# Altium project KlusterLab r2.0.PrjPcb (part 7 of 10)

## Sheet FPGA Supply Pins.SchDoc
size A3; SheetNumber: 17; SheetTotal: 32
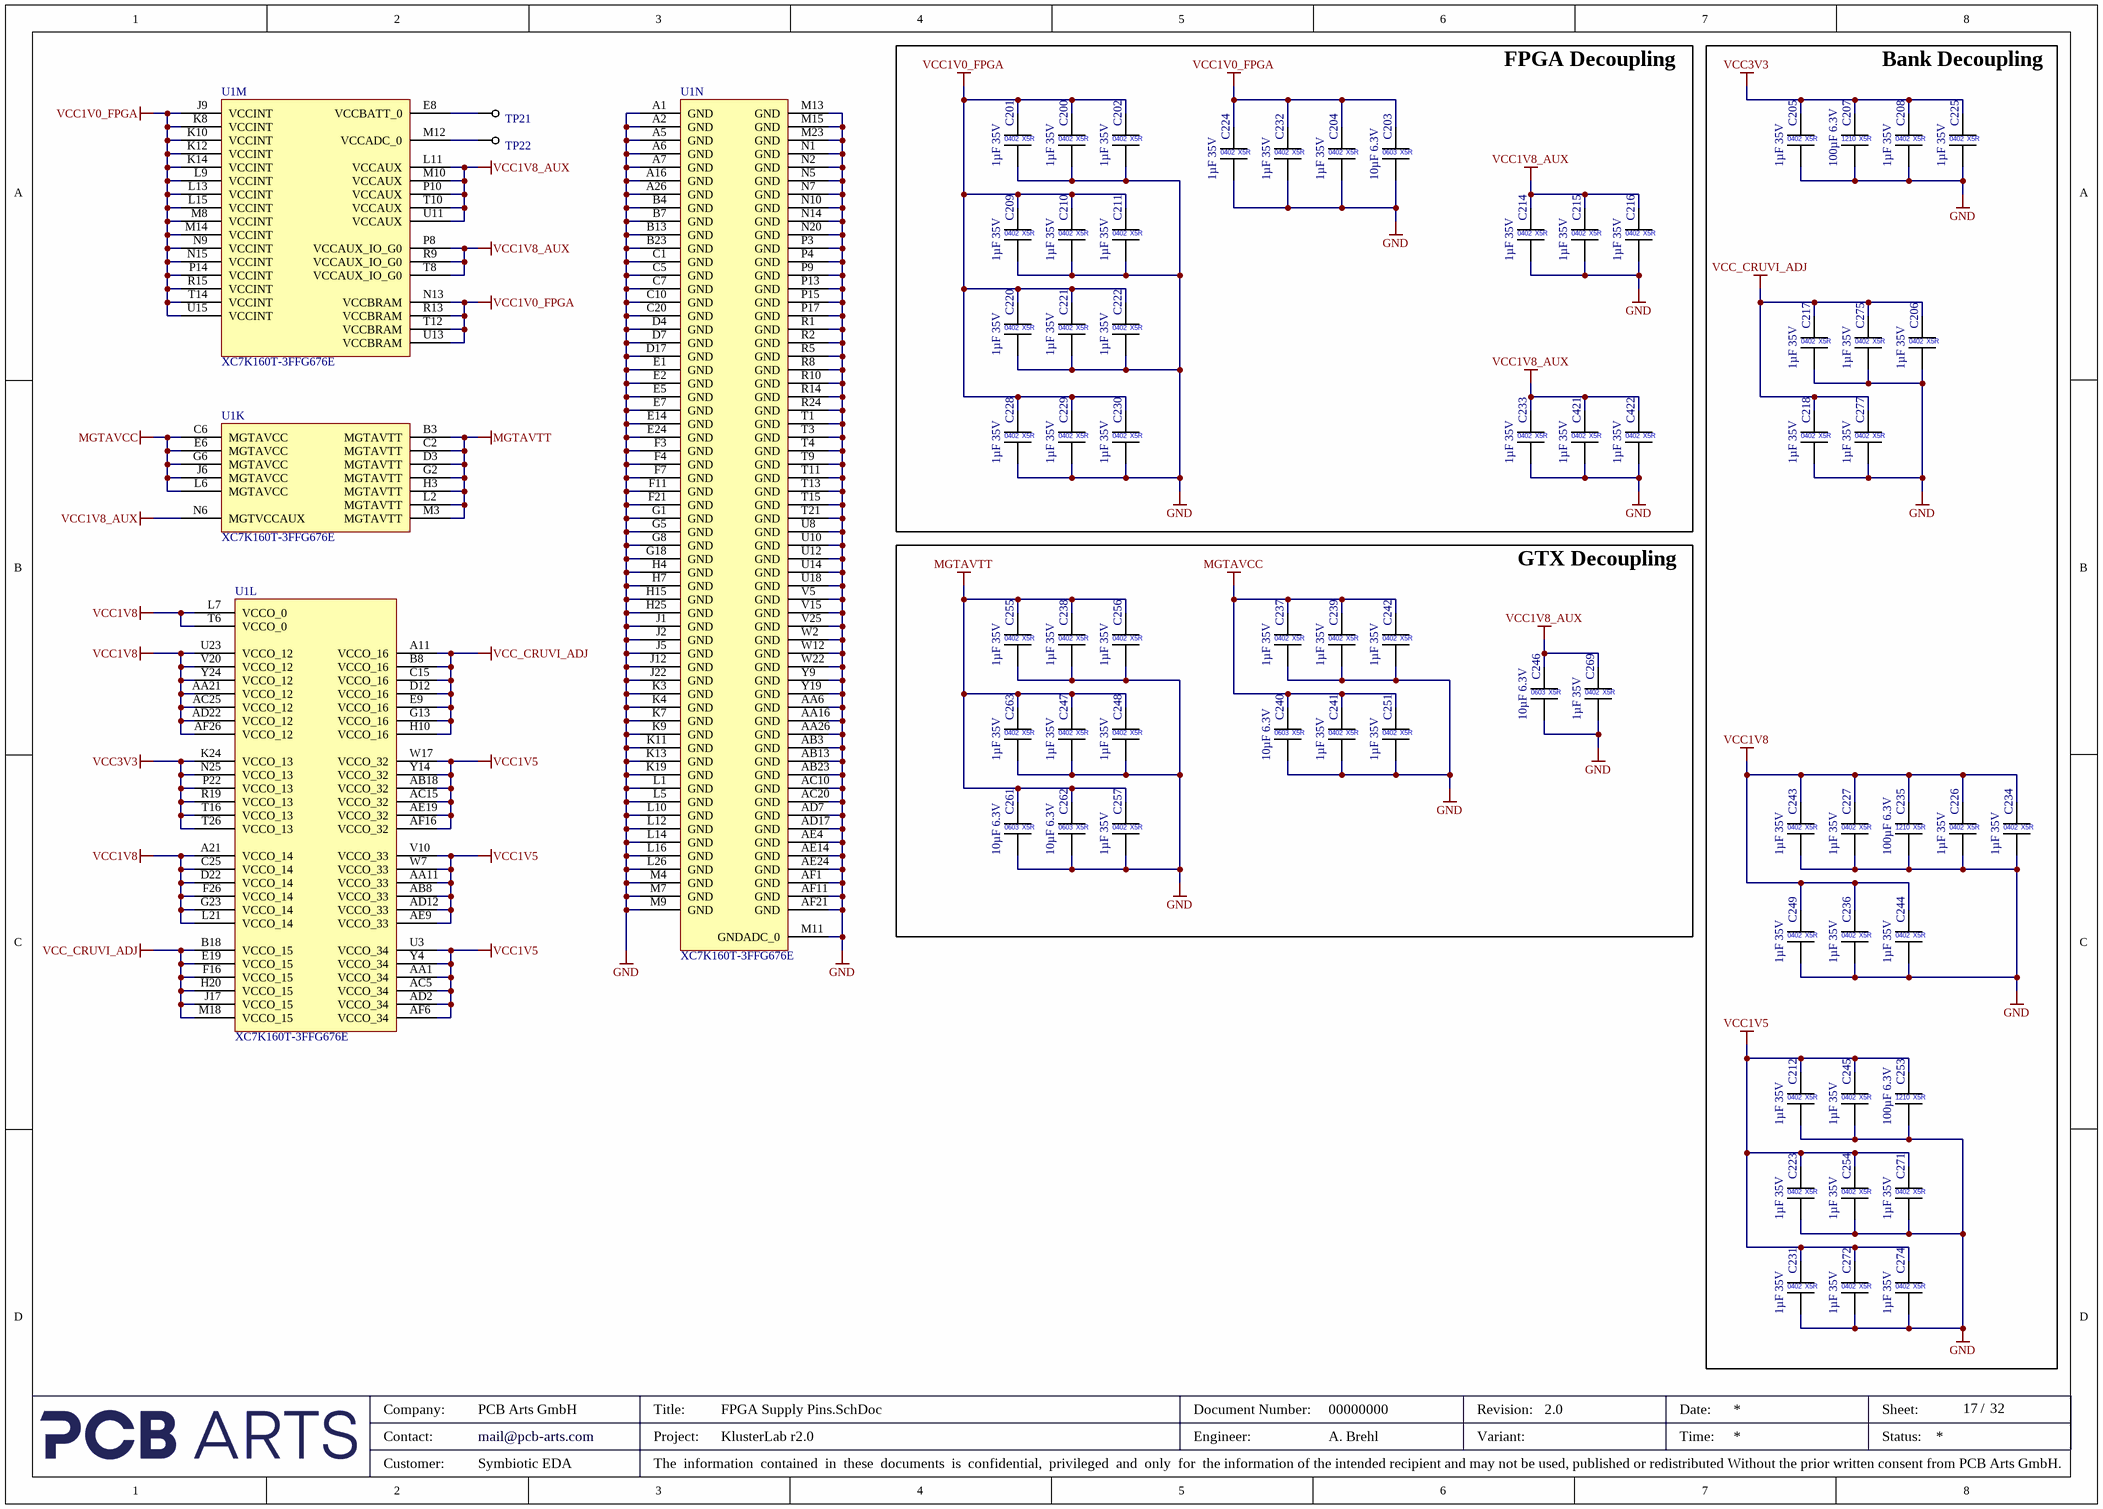
[diagram p16: FPGA Supply Pins.SchDoc]

### Parts
C200  1µF 35V  [CAP_0402_L]
C201  1µF 35V  [CAP_0402_L]
C202  1µF 35V  [CAP_0402_L]
C203  10µF 6.3V  [CAP_0603_L]
C204  1µF 35V  [CAP_0402_L]
C205  1µF 35V  [CAP_0402_L]
C206  1µF 35V  [CAP_0402_L]
C207  100µF 6.3V  [CAP_1210]
C208  1µF 35V  [CAP_0402_L]
C209  1µF 35V  [CAP_0402_L]
C210  1µF 35V  [CAP_0402_L]
C211  1µF 35V  [CAP_0402_L]
C212  1µF 35V  [CAP_0402_L]
C214  1µF 35V  [CAP_0402_L]
C215  1µF 35V  [CAP_0402_L]
C216  1µF 35V  [CAP_0402_L]
C217  1µF 35V  [CAP_0402_L]
C218  1µF 35V  [CAP_0402_L]
C220  1µF 35V  [CAP_0402_L]
C221  1µF 35V  [CAP_0402_L]
C222  1µF 35V  [CAP_0402_L]
C223  1µF 35V  [CAP_0402_L]
C224  1µF 35V  [CAP_0402_L]
C225  1µF 35V  [CAP_0402_L]
C226  1µF 35V  [CAP_0402_L]
C227  1µF 35V  [CAP_0402_L]
C228  1µF 35V  [CAP_0402_L]
C229  1µF 35V  [CAP_0402_L]
C230  1µF 35V  [CAP_0402_L]
C231  1µF 35V  [CAP_0402_L]
C232  1µF 35V  [CAP_0402_L]
C233  1µF 35V  [CAP_0402_L]
C234  1µF 35V  [CAP_0402_L]
C235  100µF 6.3V  [CAP_1210]
C236  1µF 35V  [CAP_0402_L]
C237  1µF 35V  [CAP_0402_L]
C238  1µF 35V  [CAP_0402_L]
C239  1µF 35V  [CAP_0402_L]
C240  10µF 6.3V  [CAP_0603_L]
C241  1µF 35V  [CAP_0402_L]
C242  1µF 35V  [CAP_0402_L]
C243  1µF 35V  [CAP_0402_L]
C244  1µF 35V  [CAP_0402_L]
C245  1µF 35V  [CAP_0402_L]
C246  10µF 6.3V  [CAP_0603_L]
C247  1µF 35V  [CAP_0402_L]
C248  1µF 35V  [CAP_0402_L]
C249  1µF 35V  [CAP_0402_L]
C251  1µF 35V  [CAP_0402_L]
C253  100µF 6.3V  [CAP_1210]
C254  1µF 35V  [CAP_0402_L]
C255  1µF 35V  [CAP_0402_L]
C256  1µF 35V  [CAP_0402_L]
C257  1µF 35V  [CAP_0402_L]
C261  10µF 6.3V  [CAP_0603_L]
C262  10µF 6.3V  [CAP_0603_L]
C263  1µF 35V  [CAP_0402_L]
C269  1µF 35V  [CAP_0402_L]
C271  1µF 35V  [CAP_0402_L]
C272  1µF 35V  [CAP_0402_L]
C274  1µF 35V  [CAP_0402_L]
C275  1µF 35V  [CAP_0402_L]
C277  1µF 35V  [CAP_0402_L]
C421  1µF 35V  [CAP_0402_L]
C422  1µF 35V  [CAP_0402_L]
TP21  Testpoint  [Testpoint 0.8mm]  (value not drawn)  (no BOM)
TP22  Testpoint  [Testpoint 0.8mm]  (value not drawn)  (no BOM)
U1  XC7K160T-3FFG676E  [BGA100P2700X2700X317-676N]  (parts K,L,M,N of 14)

### Blocks framed on the sheet
FPGA Decoupling: C200-C204 C209-C211 C214-C216 C220-C222 C224 C228-C230 C232 C233 C421 C422
Bank Decoupling: C205-C208 C212 C217 C218 C223 C225-C227 C231 C234-C236 C243-C245 C249 C253 C254 C271 C272 C274 C275 C277
GTX Decoupling: C237-C242 C246-C248 C251 C255-C257 C261-C263 C269

### Nets
GND: C200.2 C201.2 C202.2 C203.2 C204.2 C205.2 C206.2 C207.2 C208.2 C209.2 C210.2 C211.2 C212.2 C214.2 C215.2 C216.2 C217.2 C218.2 C220.2 C221.2 C222.2 C223.2 C224.2 C225.2 C226.2 C227.2 C228.2 C229.2 C230.2 C231.2 C232.2 C233.2 C234.2 C235.2 C236.2 C237.2 C238.2 C239.2 C240.2 C241.2 C242.2 C243.2 C244.2 C245.2 C246.2 C247.2 C248.2 C249.2 C251.2 C253.2 C254.2 C255.2 C256.2 C257.2 C261.2 C262.2 C263.2 C269.2 C271.2 C272.2 C274.2 C275.2 C277.2 C421.2 C422.2 U1.A1(GND) U1.A2(GND) U1.A5(GND) U1.A6(GND) U1.A7(GND) U1.A16(GND) U1.A26(GND) U1.AA6(GND) U1.AA16(GND) U1.AA26(GND) U1.AB3(GND) U1.AB13(GND) U1.AB23(GND) U1.AC10(GND) U1.AC20(GND) U1.AD7(GND) U1.AD17(GND) U1.AE4(GND) U1.AE14(GND) U1.AE24(GND) U1.AF1(GND) U1.AF11(GND) U1.AF21(GND) U1.B4(GND) U1.B7(GND) U1.B13(GND) U1.B23(GND) U1.C1(GND) U1.C5(GND) U1.C7(GND) U1.C10(GND) U1.C20(GND) U1.D4(GND) U1.D7(GND) U1.D17(GND) U1.E1(GND) U1.E2(GND) U1.E5(GND) U1.E7(GND) U1.E14(GND) U1.E24(GND) U1.F3(GND) U1.F4(GND) U1.F7(GND) U1.F11(GND) U1.F21(GND) U1.G1(GND) U1.G5(GND) U1.G8(GND) U1.G18(GND) U1.H4(GND) U1.H7(GND) U1.H15(GND) U1.H25(GND) U1.J1(GND) U1.J2(GND) U1.J5(GND) U1.J12(GND) U1.J22(GND) U1.K3(GND) U1.K4(GND) U1.K7(GND) U1.K9(GND) U1.K11(GND) U1.K13(GND) U1.K19(GND) U1.L1(GND) U1.L5(GND) U1.L10(GND) U1.L12(GND) U1.L14(GND) U1.L16(GND) U1.L26(GND) U1.M4(GND) U1.M7(GND) U1.M9(GND) U1.M11(GNDADC_0) U1.M13(GND) U1.M15(GND) U1.M23(GND) U1.N1(GND) U1.N2(GND) U1.N5(GND) U1.N7(GND) U1.N10(GND) U1.N14(GND) U1.N20(GND) U1.P3(GND) U1.P4(GND) U1.P9(GND) U1.P13(GND) U1.P15(GND) U1.P17(GND) U1.R1(GND) U1.R2(GND) U1.R5(GND) U1.R8(GND) U1.R10(GND) U1.R14(GND) U1.R24(GND) U1.T1(GND) U1.T3(GND) U1.T4(GND) U1.T9(GND) U1.T11(GND) U1.T13(GND) U1.T15(GND) U1.T21(GND) U1.U8(GND) U1.U10(GND) U1.U12(GND) U1.U14(GND) U1.U18(GND) U1.V5(GND) U1.V15(GND) U1.V25(GND) U1.W2(GND) U1.W12(GND) U1.W22(GND) U1.Y9(GND) U1.Y19(GND)
MGTAVCC: C237.1 C239.1 C240.1 C241.1 C242.1 C251.1 U1.C6(MGTAVCC) U1.E6(MGTAVCC) U1.G6(MGTAVCC) U1.J6(MGTAVCC) U1.L6(MGTAVCC)
MGTAVTT: C238.1 C247.1 C248.1 C255.1 C256.1 C257.1 C261.1 C262.1 C263.1 U1.B3(MGTAVTT) U1.C2(MGTAVTT) U1.D3(MGTAVTT) U1.G2(MGTAVTT) U1.H3(MGTAVTT) U1.L2(MGTAVTT) U1.M3(MGTAVTT)
VCC1V0_FPGA: C200.1 C201.1 C202.1 C203.1 C204.1 C209.1 C210.1 C211.1 C220.1 C221.1 C222.1 C224.1 C228.1 C229.1 C230.1 C232.1 U1.J9(VCCINT) U1.K8(VCCINT) U1.K10(VCCINT) U1.K12(VCCINT) U1.K14(VCCINT) U1.L9(VCCINT) U1.L13(VCCINT) U1.L15(VCCINT) U1.M8(VCCINT) U1.M14(VCCINT) U1.N9(VCCINT) U1.N13(VCCBRAM) U1.N15(VCCINT) U1.P14(VCCINT) U1.R13(VCCBRAM) U1.R15(VCCINT) U1.T12(VCCBRAM) U1.T14(VCCINT) U1.U13(VCCBRAM) U1.U15(VCCINT)
VCC1V5: C212.1 C223.1 C231.1 C245.1 C253.1 C254.1 C271.1 C272.1 C274.1 U1.AA1(VCCO_34) U1.AA11(VCCO_33) U1.AB8(VCCO_33) U1.AB18(VCCO_32) U1.AC5(VCCO_34) U1.AC15(VCCO_32) U1.AD2(VCCO_34) U1.AD12(VCCO_33) U1.AE9(VCCO_33) U1.AE19(VCCO_32) U1.AF6(VCCO_34) U1.AF16(VCCO_32) U1.U3(VCCO_34) U1.V10(VCCO_33) U1.W7(VCCO_33) U1.W17(VCCO_32) U1.Y4(VCCO_34) U1.Y14(VCCO_32)
VCC1V8: C226.1 C227.1 C234.1 C235.1 C236.1 C243.1 C244.1 C249.1 U1.A21(VCCO_14) U1.AA21(VCCO_12) U1.AC25(VCCO_12) U1.AD22(VCCO_12) U1.AF26(VCCO_12) U1.C25(VCCO_14) U1.D22(VCCO_14) U1.F26(VCCO_14) U1.G23(VCCO_14) U1.L7(VCCO_0) U1.L21(VCCO_14) U1.T6(VCCO_0) U1.U23(VCCO_12) U1.V20(VCCO_12) U1.Y24(VCCO_12)
VCC1V8_AUX: C214.1 C215.1 C216.1 C233.1 C246.1 C269.1 C421.1 C422.1 U1.L11(VCCAUX) U1.M10(VCCAUX) U1.N6(MGTVCCAUX) U1.P8(VCCAUX_IO_G0) U1.P10(VCCAUX) U1.R9(VCCAUX_IO_G0) U1.T8(VCCAUX_IO_G0) U1.T10(VCCAUX) U1.U11(VCCAUX)
VCC3V3: C205.1 C207.1 C208.1 C225.1 U1.K24(VCCO_13) U1.N25(VCCO_13) U1.P22(VCCO_13) U1.R19(VCCO_13) U1.T16(VCCO_13) U1.T26(VCCO_13)
VCC_CRUVI_ADJ: C206.1 C217.1 C218.1 C275.1 C277.1 U1.A11(VCCO_16) U1.B8(VCCO_16) U1.B18(VCCO_15) U1.C15(VCCO_16) U1.D12(VCCO_16) U1.E9(VCCO_16) U1.E19(VCCO_15) U1.F16(VCCO_15) U1.G13(VCCO_16) U1.H10(VCCO_16) U1.H20(VCCO_15) U1.J17(VCCO_15) U1.M18(VCCO_15)
NetTP21_1: TP21.1(GND) U1.E8(VCCBATT_0)
NetTP22_1: TP22.1(GND) U1.M12(VCCADC_0)

### Notes on the sheet
- Company:
- Contact:
- Customer:
- mail@pcb-arts.com
- PCB Arts GmbH
- Title:
- Project:
- The  information  contained  in  these  documents  is  confidential,  privileged  and  only  for  the information of the intended recipient and may not be used, published or redistributed Without the prior written consent from PCB Arts GmbH.
- Engineer:
- Document Number:
- Revision:
- Variant:
- Date:
- Time:
- Sheet:
- Status:
- /
- (in symbol CAP_0402_1µF_35V) 0402; X5R
- (in symbol CAP_0603_10µF_6.3V) 0603; X5R
- (in symbol CAP_1210_100µF_6.3V) 1210; X5R

### Library data of the parts
C200-C202 C204-C206 C208-C212 C214-C218 C220-C234 C236-C239 C241-C245 C247-C249 C251 C254-C257 C263 C269 C271 C272 C274 C275 C277 C421 C422 = CAP_0402_1µF_35V: Multilayer Ceramic Capacitors MLCC - SMD/SMT 0402 35VDC; Manufacturer 1: Kyocera Electronic Components; Manufacturer 1 Prt. Nr.: CM05X5R105K35AH; Manufacturer 2 Prt. Nr.: C1005X5R1V105K050BC; Manufacturer 2: TDK
C203 C240 C246 C261 C262 = CAP_0603_10µF_6.3V: Multilayer Ceramic Capacitors MLCC - SMD/SMT 0603 6.3VDC; Manufacturer 1: Murata Electronics; Manufacturer 1 Prt. Nr.: GRM188R60J106ME84J; Manufacturer 2 Prt. Nr.: JMK107ABJ106MA-T; Manufacturer 2: Taiyo Yuden
C207 C235 C253 = CAP_1210_100µF_6.3V: Multilayer Ceramic Capacitors MLCC - SMD/SMT 1210 6.3VDC; Manufacturer 1: Samsung Electro-Mechanics; Manufacturer 1 Prt. Nr.: CL32A107MQVNNWE; Manufacturer 2 Prt. Nr.: JMK325ABJ107MMHP; Manufacturer 2: Taiyo Yuden
TP21 TP22 = Testpoint 0.8mm
U1 = XC7K160T-3FFG676E_Kintex-7 FPGA, 400 User I/Os, 8 GTX, FFG676: Kintex-7 FPGA, 400 User I/Os, 8 GTX, 676-Ball BGA, Speed Grade 3, Extended Grade, Pb-Free; Manufacturer 1: Xilinx; Manufacturer 1 Prt. Nr.: XC7K160T-3FFG676E; ComponentLink1URL: http://www.xilinx.com/support/documentation/data_sheets/ds180_7Series_Overview.pdf; ComponentLink2URL: http://www.xilinx.com/support/documentation/user_guides/ug865-Zynq-7000-Pkg-Pinout.pdf; ComponentLink1Description: Datasheet; ComponentLink2Description: Package Specification

## Sheet Power-Tree.SchDoc
size A3; SheetNumber: 2; SheetTotal: 32
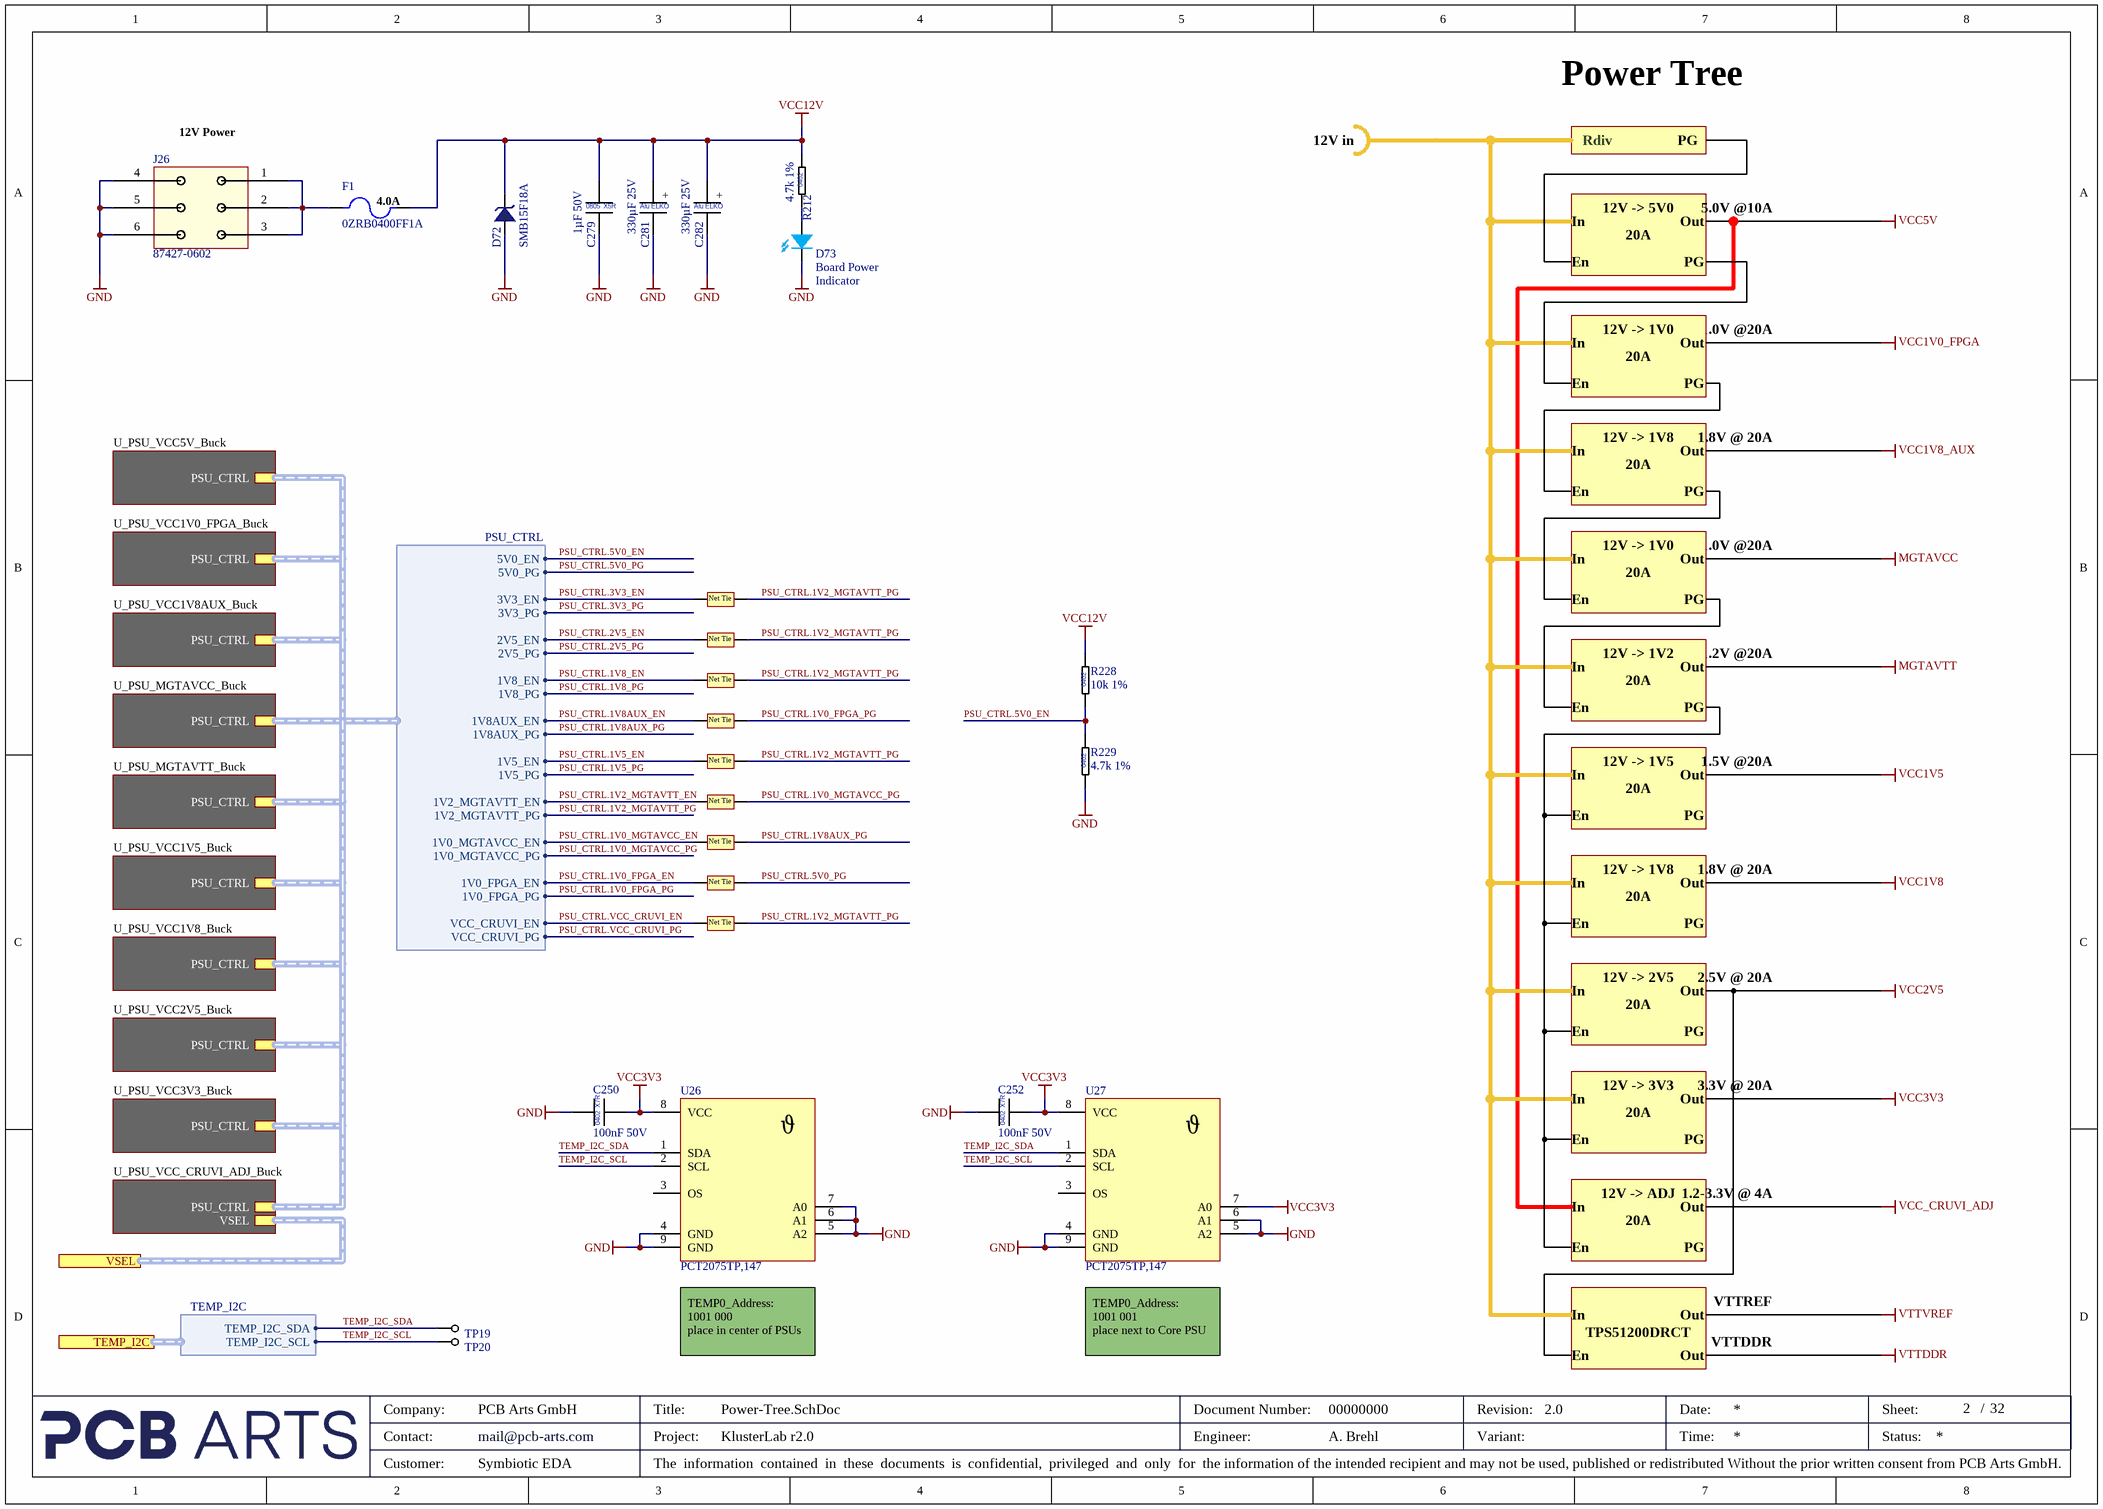
[diagram p17: Power-Tree.SchDoc]

### Parts
C250  100nF 50V  [CAP_0402_L]
C252  100nF 50V  [CAP_0402_L]
C279  1µF 50V  [CAP_0805]
C281  330µF 25V  [WCAP-PTG5_D10H12.5]
C282  330µF 25V  [WCAP-PTG5_D10H12.5]
D72  SMB15F18A  [DO221-AA]
D73  LTST-S270TBKT  [LED-0603 Sideview]  (value not drawn)
F1  0ZRB0400FF1A  [0ZRB0400FF]
J26  87427-0602  [Molex 87427-0602]
NT1  Net Tie  [Net Tie-0.3]  (value not drawn)  (net tie, no BOM)
NT2  Net Tie  [Net Tie-0.3]  (value not drawn)  (net tie, no BOM)
NT3  Net Tie  [Net Tie-0.3]  (value not drawn)  (net tie, no BOM)
NT4  Net Tie  [Net Tie-0.3]  (value not drawn)  (net tie, no BOM)
NT5  Net Tie  [Net Tie-0.3]  (value not drawn)  (net tie, no BOM)
NT6  Net Tie  [Net Tie-0.3]  (value not drawn)  (net tie, no BOM)
NT7  Net Tie  [Net Tie-0.3]  (value not drawn)  (net tie, no BOM)
NT8  Net Tie  [Net Tie-0.3]  (value not drawn)  (net tie, no BOM)
NT9  Net Tie  [Net Tie-0.3]  (value not drawn)  (net tie, no BOM)
R212  4.7k 1%  [RES_0402_L]
R228  10k 1%  [RES_0402_L]
R229  4.7k 1%  [RES_0402_L]
TP19  Testpoint  [Testpoint 0.8mm]  (value not drawn)  (no BOM)
TP20  Testpoint  [Testpoint 0.8mm]  (value not drawn)  (no BOM)
U26  PCT2075TP,147  [SOT1069-2 (HWSON8)]
U27  PCT2075TP,147  [SOT1069-2 (HWSON8)]

### Sub-sheets
U_PSU_MGTAVCC_Buck = PSU_MGTAVCC_Buck.SchDoc: PSU_CTRL (harness PSU_CTRL)
U_PSU_MGTAVTT_Buck = PSU_MGTAVTT_Buck.SchDoc: PSU_CTRL (harness PSU_CTRL)
U_PSU_VCC1V0_FPGA_Buck = PSU_VCC1V0_FPGA_Buck.SchDoc: PSU_CTRL (harness PSU_CTRL)
U_PSU_VCC1V5_Buck = PSU_VCC1V5_Buck.SchDoc: PSU_CTRL (harness PSU_CTRL)
U_PSU_VCC1V8_Buck = PSU_VCC1V8_Buck.SchDoc: PSU_CTRL (harness PSU_CTRL)
U_PSU_VCC1V8AUX_Buck = PSU_VCC1V8AUX_Buck.SchDoc: PSU_CTRL (harness PSU_CTRL)
U_PSU_VCC2V5_Buck = PSU_VCC2V5_Buck.SchDoc: PSU_CTRL (harness PSU_CTRL)
U_PSU_VCC3V3_Buck = PSU_VCC3V3_Buck.SchDoc: PSU_CTRL (harness PSU_CTRL)
U_PSU_VCC5V_Buck = PSU_VCC5V_Buck.SchDoc: PSU_CTRL (harness PSU_CTRL)
U_PSU_VCC_CRUVI_ADJ_Buck = PSU_VCC_CRUVI_ADJ_Buck.SchDoc: PSU_CTRL (harness PSU_CTRL), VSEL (harness VSEL)

### Ports
TEMP_I2C (harness TEMP_I2C, see Top-Level-Sheet[6D], SMI Bank 12[1C]), VSEL (harness VSEL, see Top-Level-Sheet[6C], Bank 13_Bank 15_Bank 16[8D], PSU_VCC_CRUVI_ADJ_Buck[1C])

### Harnesses
TEMP_I2C: TEMP_I2C_SCL, TEMP_I2C_SDA
PSU_CTRL: 5V0_EN, 5V0_PG, 3V3_EN, 3V3_PG, 2V5_EN, 2V5_PG, 1V8_EN, 1V8_PG, 1V8AUX_EN, 1V8AUX_PG, 1V5_EN, 1V5_PG, 1V2_MGTAVTT_EN, 1V2_MGTAVTT_PG, 1V0_MGTAVCC_EN, 1V0_MGTAVCC_PG, 1V0_FPGA_EN, 1V0_FPGA_PG, VCC_CRUVI_EN, VCC_CRUVI_PG

### Nets
GND: C250.1 C252.1 C279.2 C281.2 C282.2 D72.2 D73.1 J26.4 J26.5 J26.6 R229.1 U26.4(GND) U26.5(A2) U26.6(A1) U26.7(A0) U26.9(GND) U27.4(GND) U27.5(A2) U27.6(A1) U27.9(GND)
VCC3V3: C250.2 C252.2 U26.8(VCC) U27.7(A0) U27.8(VCC)
VCC12V: C279.1 C281.1 C282.1 D72.1 F1.2 R212.2 R228.2
PSU_CTRL.1V0_FPGA_EN: NT8.1 ; sheet U_PSU_MGTAVCC_Buck/PSU_CTRL.1V0_FPGA_EN
PSU_CTRL.1V0_FPGA_PG: NT4.2 ; sheet U_PSU_MGTAVCC_Buck/PSU_CTRL.1V0_FPGA_PG
PSU_CTRL.1V0_MGTAVCC_EN: NT7.1 ; sheet U_PSU_MGTAVCC_Buck/PSU_CTRL.1V0_MGTAVCC_EN
PSU_CTRL.1V0_MGTAVCC_PG: NT6.2 ; sheet U_PSU_MGTAVCC_Buck/PSU_CTRL.1V0_MGTAVCC_PG
PSU_CTRL.1V2_MGTAVTT_EN: NT6.1 ; sheet U_PSU_MGTAVCC_Buck/PSU_CTRL.1V2_MGTAVTT_EN
PSU_CTRL.1V2_MGTAVTT_PG: NT1.2 NT2.2 NT3.2 NT5.2 NT9.2 ; sheet U_PSU_MGTAVCC_Buck/PSU_CTRL.1V2_MGTAVTT_PG
PSU_CTRL.1V5_EN: NT5.1 ; sheet U_PSU_MGTAVCC_Buck/PSU_CTRL.1V5_EN
PSU_CTRL.1V8_EN: NT3.1 ; sheet U_PSU_MGTAVCC_Buck/PSU_CTRL.1V8_EN
PSU_CTRL.1V8AUX_EN: NT4.1 ; sheet U_PSU_MGTAVCC_Buck/PSU_CTRL.1V8AUX_EN
PSU_CTRL.1V8AUX_PG: NT7.2 ; sheet U_PSU_MGTAVCC_Buck/PSU_CTRL.1V8AUX_PG
PSU_CTRL.2V5_EN: NT2.1 ; sheet U_PSU_MGTAVCC_Buck/PSU_CTRL.2V5_EN
PSU_CTRL.3V3_EN: NT1.1 ; sheet U_PSU_MGTAVCC_Buck/PSU_CTRL.3V3_EN
PSU_CTRL.5V0_EN: R228.1 R229.2 ; sheet U_PSU_MGTAVCC_Buck/PSU_CTRL.5V0_EN
PSU_CTRL.5V0_PG: NT8.2 ; sheet U_PSU_MGTAVCC_Buck/PSU_CTRL.5V0_PG
PSU_CTRL.VCC_CRUVI_EN: NT9.1 ; sheet U_PSU_MGTAVCC_Buck/PSU_CTRL.VCC_CRUVI_EN
TEMP_I2C_SCL: TP20.1(GND) U26.2(SCL) U27.2(SCL) ; port TEMP_I2C.TEMP_I2C_SCL
TEMP_I2C_SDA: TP19.1(GND) U26.1(SDA) U27.1(SDA) ; port TEMP_I2C.TEMP_I2C_SDA
NetD73_2: D73.2 R212.1
NetF1_1: F1.1 J26.1 J26.2 J26.3

Not connected (* = marked no-connect by the designer): U26 3(OS); U27 3(OS)

### Buses and harness runs
harness port VSEL = sheet U_PSU_VCC_CRUVI_ADJ_Buck/VSEL
harness sheet U_PSU_MGTAVCC_Buck/PSU_CTRL = sheet U_PSU_MGTAVTT_Buck/PSU_CTRL = sheet U_PSU_VCC1V0_FPGA_Buck/PSU_CTRL = sheet U_PSU_VCC1V5_Buck/PSU_CTRL = sheet U_PSU_VCC1V8_Buck/PSU_CTRL = sheet U_PSU_VCC1V8AUX_Buck/PSU_CTRL = sheet U_PSU_VCC2V5_Buck/PSU_CTRL = sheet U_PSU_VCC3V3_Buck/PSU_CTRL = sheet U_PSU_VCC5V_Buck/PSU_CTRL = sheet U_PSU_VCC_CRUVI_ADJ_Buck/PSU_CTRL

### Notes on the sheet
- Power Tree
- (near J26) 12V Power
- 12V in
- Rdiv
- PG
- In
- 12V -> 5V0
- 20A
- Out
- 5.0V @10A
- VCC5V
- (near D73) Board Power
- (near D73) Indicator
- En
- 12V -> 1V0
- 1.0V @20A
- VCC1V0_FPGA
- 12V -> 1V8
- 1.8V @ 20A
- VCC1V8_AUX
- MGTAVCC
- 12V -> 1V2
- 1.2V @20A
- MGTAVTT
- 12V -> 1V5
- 1.5V @20A
- VCC1V5
- VCC1V8
- 12V -> 2V5
- 2.5V @ 20A
- VCC2V5
- 12V -> 3V3
- 3.3V @ 20A
- VCC3V3
- 12V -> ADJ
- 1.2-3.3V @ 4A
- VCC_CRUVI_ADJ
- VTTREF
- VTTVREF
- (near U26) TEMP0_Address:
  1001 000
  place in center of PSUs
- (near U27) TEMP0_Address:
  1001 001
  place next to Core PSU
- TPS51200DRCT
- VTTDDR
- Company:
- Contact:
- Customer:
- mail@pcb-arts.com
- PCB Arts GmbH
- Title:
- Project:
- The  information  contained  in  these  documents  is  confidential,  privileged  and  only  for  the information of the intended recipient and may not be used, published or redistributed Without the prior written consent from PCB Arts GmbH.
- Engineer:
- Document Number:
- Revision:
- Variant:
- Date:
- Time:
- Sheet:
- Status:
- /
- (in symbol 0ZRB0400FF1A_Rückstellbare Sicherung 4.0A, 30V) 4.0A
- (in symbol CAP_0402_100nF_50V) X7R; 0402
- (in symbol CAP_0805_1µF_50V) 0805; X5R
- (in symbol CAP_D10L12.5_330µF_25V) +; Alu ELKO
- (in symbol PCT2075TP,147_Digital Temp Sensor I2C) ϑ
- (in symbol RES_0402_4.7k_1%) 0402
- (in symbol RES_0402_10k_1%) 0402

### Library data of the parts
C250 C252 = CAP_0402_100nF_50V: Multilayer Ceramic Capacitors MLCC - SMD/SMT 0402 50VDC; Manufacturer 1: Murata Electronics; Manufacturer 1 Prt. Nr.: GCM155L8EH104KE07D; Manufacturer 2 Prt. Nr.: UMK105B7104KV-FR; Manufacturer 2: TDK
C279 = CAP_0805_1µF_50V: Multilayer Ceramic Capacitors MLCC - SMD/SMT 0805 50VDC; Manufacturer 1: Samsung Electro-Mechanics; Manufacturer 1 Prt. Nr.: CL21B105KBFNNNG; Manufacturer 2 Prt. Nr.: UMK212BJ105KGHT; Manufacturer 2: Taiyo Yuden
C281 C282 = CAP_D10L12.5_330µF_25V: Organische Polymer-Aluminiumkondensatoren 330uF 25 Volts 20% AEC-Q200; Manufacturer 1: Würth Elektronik; Manufacturer 1 Prt. Nr.: 870025575009
D72 = SMB15F18A_ESD-Entstörer/TVS-Dioden 1500 W, 18 V TVS: ESD-Entstörer/TVS-Dioden 1500 W, 18 V TVS; Manufacturer 1: STMicroelectronics; Manufacturer 1 Prt. Nr.: SMB15F18A
D73 = LED 0603 Blue Sideview: BLUE  0603 Light Emitting Diode; Manufacturer 1: lite-On; Manufacturer 1 Prt. Nr.: LTST-S270TBKT; Color: Blue
F1 = 0ZRB0400FF1A_Rückstellbare Sicherung 4.0A, 30V: Rückstellbare Sicherung 4.0A, 30V; Manufacturer 1: Bel Fuse; Manufacturer 1 Prt. Nr.: 0ZRB0400FF1A
J26 = 87427-0602_Mini-Fit Jr. Right angle Header, 4.20mm Pitch, Dual Row, 6 Circuits: Mini-Fit Jr. Right angle Header, 4.20mm Pitch, Dual Row, 6 Circuits; Manufacturer 1: MOLEX; Manufacturer 1 Prt. Nr.: 874270602
R212 R229 = RES_0402_4.7k_1%: Thick Film Resistors - SMD 4.7kOhm 1%; Manufacturer 1: Vishay / Dale; Manufacturer 1 Prt. Nr.: CRCW04024K70FKEDC; Manufacturer 2 Prt. Nr.: RC0402FR-134K7L; Manufacturer 2: Yageo
R228 = RES_0402_10k_1%: Thick Film Resistors - SMD 10kOhm 1%; Manufacturer 1: Vishay / Dale; Manufacturer 1 Prt. Nr.: CRCW040210K0FKEDC; Manufacturer 2 Prt. Nr.: RC0402FR-7W10KL; Manufacturer 2: Yageo
TP19 TP20 = Testpoint 0.8mm
U26 U27 = PCT2075TP,147_Digital Temp Sensor I2C: Digital Temp Sensor I2C; Manufacturer 1: NXP; Manufacturer 1 Prt. Nr.: PCT2075TP,147

## Sheet PSU_MGTAVCC_Buck.SchDoc
size A3; SheetNumber: 9; SheetTotal: 32
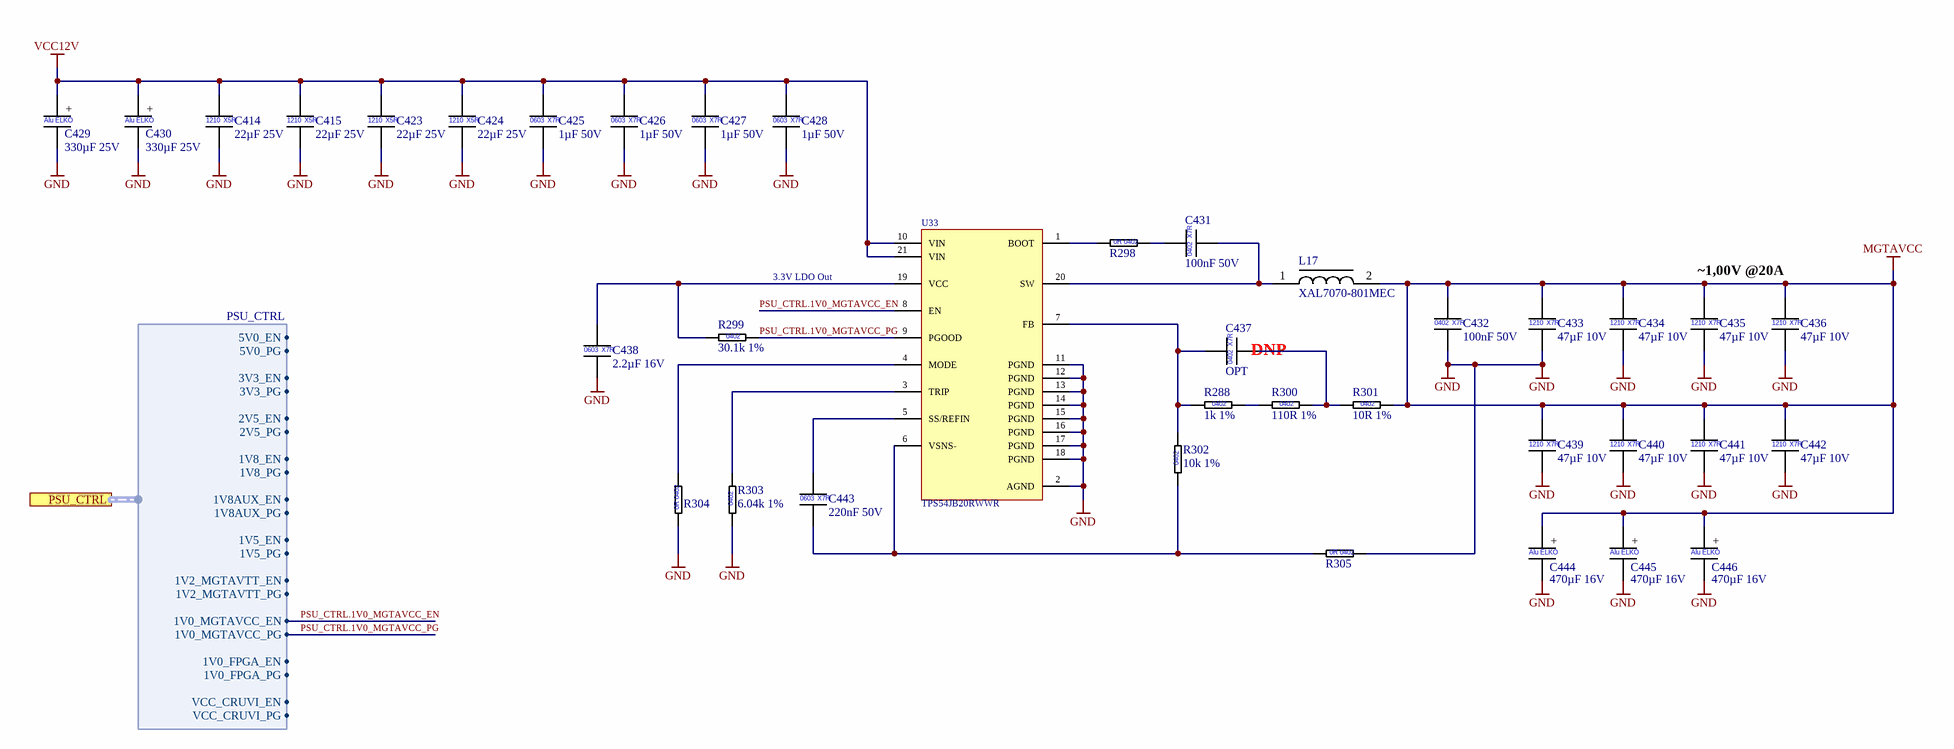
[diagram p18: PSU_MGTAVCC_Buck.SchDoc]

### Parts
C414  22µF 25V  [CAP_1210]
C415  22µF 25V  [CAP_1210]
C423  22µF 25V  [CAP_1210]
C424  22µF 25V  [CAP_1210]
C425  1µF 50V  [CAP_0603]
C426  1µF 50V  [CAP_0603]
C427  1µF 50V  [CAP_0603]
C428  1µF 50V  [CAP_0603]
C429  330µF 25V  [WCAP-PTG5_D10H12.5]
C430  330µF 25V  [WCAP-PTG5_D10H12.5]
C431  100nF 50V  [CAP_0402]
C432  100nF 50V  [CAP_0402]
C433  47µF 10V  [CAP_1210]
C434  47µF 10V  [CAP_1210]
C435  47µF 10V  [CAP_1210]
C436  47µF 10V  [CAP_1210]
C437  OPT  [CAP_0402]  (no BOM)
C438  2.2µF 16V  [CAP_0603]
C439  47µF 10V  [CAP_1210]
C440  47µF 10V  [CAP_1210]
C441  47µF 10V  [CAP_1210]
C442  47µF 10V  [CAP_1210]
C443  220nF 50V  [CAP_0603]
C444  470µF 16V  [WCAP-PTG5_D8H13]
C445  470µF 16V  [WCAP-PTG5_D8H13]
C446  470µF 16V  [WCAP-PTG5_D8H13]
L17  XAL7070-801MEC  [COILCRAFT_XAL7070]
R288  1k 1%  [RES_0402]
R298  0R Jumper  [RES_0402]  (value not drawn)
R299  30.1k 1%  [RES_0402]
R300  110R 1%  [RES_0402]
R301  10R 1%  [RES_0402]
R302  10k 1%  [RES_0402]
R303  6.04k 1%  [RES_0402]
R304  0R Jumper  [RES_0402]  (value not drawn)
R305  0R Jumper  [RES_0402]  (value not drawn)
U33  TPS54JB20RWWR  [VQFN-HR21_RWW0021A]

### Ports
PSU_CTRL (harness PSU_CTRL, see Power-Tree[2B], PSU_MGTAVTT_Buck[1B], PSU_VCC1V0_FPGA_Buck[1B], PSU_VCC1V5_Buck[1B], PSU_VCC1V8_Buck[1B], PSU_VCC1V8AUX_Buck[1B], PSU_VCC2V5_Buck[1B], PSU_VCC3V3_Buck[1B], PSU_VCC5V_Buck[1B], PSU_VCC_CRUVI_ADJ_Buck[1B])

### Harnesses
PSU_CTRL: 5V0_EN, 5V0_PG, 3V3_EN, 3V3_PG, 2V5_EN, 2V5_PG, 1V8_EN, 1V8_PG, 1V8AUX_EN, 1V8AUX_PG, 1V5_EN, 1V5_PG, 1V2_MGTAVTT_EN, 1V2_MGTAVTT_PG, 1V0_MGTAVCC_EN, 1V0_MGTAVCC_PG, 1V0_FPGA_EN, 1V0_FPGA_PG, VCC_CRUVI_EN, VCC_CRUVI_PG

### Nets
GND: C414.2 C415.2 C423.2 C424.2 C425.2 C426.2 C427.2 C428.2 C429.2 C430.2 C432.2 C433.2 C434.2 C435.2 C436.2 C438.2 C439.2 C440.2 C441.2 C442.2 C444.2 C445.2 C446.2 R303.1 R304.1 R305.2 U33.2(AGND) U33.11(PGND) U33.12(PGND) U33.13(PGND) U33.14(PGND) U33.15(PGND) U33.16(PGND) U33.17(PGND) U33.18(PGND)
MGTAVCC: C432.1 C433.1 C434.1 C435.1 C436.1 C439.1 C440.1 C441.1 C442.1 C444.1 C445.1 C446.1 L17.2 R301.2
VCC12V: C414.1 C415.1 C423.1 C424.1 C425.1 C426.1 C427.1 C428.1 C429.1 C430.1 U33.10(VIN) U33.21(VIN)
PSU_CTRL.1V0_MGTAVCC_EN: U33.8(EN) ; port PSU_CTRL.1V0_MGTAVCC_EN
PSU_CTRL.1V0_MGTAVCC_PG: R299.2 U33.9(PGOOD) ; port PSU_CTRL.1V0_MGTAVCC_PG
NetC431_1: C431.1 R298.2
NetC431_2: C431.2 L17.1 U33.20(SW)
NetC437_1: C437.1 R288.1 R302.2 U33.7(FB)
NetC437_2: C437.2 R300.2 R301.1
NetC438_1: C438.1 R299.1 U33.19(VCC)
NetC443_1: C443.1 U33.5(SS/REFIN)
NetC443_2: C443.2 R302.1 R305.1 U33.6(VSNS-)
NetR288_2: R288.2 R300.1
NetR298_1: R298.1 U33.1(BOOT)
NetR303_2: R303.2 U33.3(TRIP)
NetR304_2: R304.2 U33.4(MODE)

### Notes on the sheet
- 3.3V LDO Out
- (near C436) ~1,00V @20A
- (near C437) DNP
- Company:
- Contact:
- Customer:
- mail@pcb-arts.com
- PCB Arts GmbH
- Title:
- Project:
- The  information  contained  in  these  documents  is  confidential,  privileged  and  only  for  the information of the intended recipient and may not be used, published or redistributed Without the prior written consent from PCB Arts GmbH.
- Engineer:
- Document Number:
- Revision:
- Variant:
- Date:
- Time:
- Sheet:
- Status:
- /
- (in symbol CAP_0402_100nF_50V) X7R; 0402
- (in symbol CAP_0402_OPT) X7R; 0402
- (in symbol CAP_0603_1µF_50V_X7R_10%) 0603; X7R
- (in symbol CAP_0603_2.2µF_16V_X7R_10%) 0603; X7R
- (in symbol CAP_0603_220nF_50V_X7R_10%) 0603; X7R
- (in symbol CAP_1210_22µF_25V) 1210; X5R
- (in symbol CAP_1210_47µF_10V_X7R_10%) 1210; X7R
- (in symbol CAP_D8L9_470µF_16V) +; Alu ELKO
- (in symbol CAP_D10L12.5_330µF_25V) +; Alu ELKO
- (in symbol RES_0402_0R Jumper) 0R 0402
- (in symbol RES_0402_1k_1%) 0402
- (in symbol RES_0402_6.04k_1%) 0402
- (in symbol RES_0402_10k_1%) 0402
- (in symbol RES_0402_10R_1%) 0402
- (in symbol RES_0402_30.1k_1%) 0402
- (in symbol RES_0402_110R_1%) 0402

### Library data of the parts
C414 C415 C423 C424 = CAP_1210_22µF_25V: Multilayer Ceramic Capacitors MLCC - SMD/SMT 1210 25VDC; Manufacturer 1: KEMET; Manufacturer 1 Prt. Nr.: C1210C226K3PACTU; Manufacturer 2 Prt. Nr.: TMK212BBJ226MG-TT; Manufacturer 2: Taiyo Yuden
C425-C428 = CAP_0603_1µF_50V_X7R_10%: Multilayer Ceramic Capacitors MLCC - SMD/SMT 50V 1uF X7R 0603 10%; Manufacturer 1: KYOCERA AVX; Manufacturer 1 Prt. Nr.: 06035C105KAT2A; Manufacturer 2 Prt. Nr.: MSASU168AB7105KTNA01; Manufacturer 2: TAIYO YUDEN
C429 C430 = CAP_D10L12.5_330µF_25V: as C281 on sheet Power-Tree
C431 C432 = CAP_0402_100nF_50V: as C250 on sheet Power-Tree; Manufacturer 2: TDK
C433-C436 C439-C442 = CAP_1210_47µF_10V_X7R_10%: Multilayer Ceramic Capacitors MLCC - SMD/SMT 47 uF 10 VDC 10% 1210 X7R; Manufacturer 1: Murata Electronics; Manufacturer 1 Prt. Nr.: GRM32ER71A476KE15L; Manufacturer 2 Prt. Nr.: C1210C106K8RACTU; Manufacturer 2: KEMET
C437 = CAP_0402_OPT: Multilayer Ceramic Capacitors MLCC - SMD/SMT 0402 Optional Placeholder
C438 = CAP_0603_2.2µF_16V_X7R_10%: Multilayer Ceramic Capacitors MLCC - SMD/SMT 2.2 uF 16 VDC 10% 0603 X7R; Manufacturer 1: Murata Electronics; Manufacturer 1 Prt. Nr.: GRM188Z71C225KE43D; Manufacturer 2 Prt. Nr.: EMK107BB7225KA-T; Manufacturer 2: TAIYO YUDEN
C443 = CAP_0603_220nF_50V_X7R_10%: Multilayer Ceramic Capacitors MLCC - SMD/SMT 0.22 uF 50 VDC 10% 0603 X7R; Manufacturer 1: Murata Electronics; Manufacturer 1 Prt. Nr.: GRJ188R71H224KE11D; Manufacturer 2 Prt. Nr.: CGA3E3X7R1H224K080AE; Manufacturer 2: TDK
C444-C446 = CAP_D8L9_470µF_16V: Organische Polymer-Aluminiumkondensatoren 470uF 16 Volts 20%; Manufacturer 1: Würth Elektronik; Manufacturer 1 Prt. Nr.: 870025374007
L17 = XAL7070-801MEC_Power Inductors SMD 800nH Shld 20% 25.8A 2.29mOhms AECQ200: Power Inductors - SMD 800nH Shld 20% 25.8A 2.29mOhms AECQ200; Manufacturer 1: Coilcraft; Manufacturer 1 Prt. Nr.: XAL7070-801MEC
R288 = RES_0402_1k_1%: Thick Film Resistors - SMD 1kOhm 1%; Manufacturer 1: Vishay / Dale; Manufacturer 1 Prt. Nr.: CRCW04021K00FKEDC; Manufacturer 2 Prt. Nr.: RC0402FR-7W1KL; Manufacturer 2: Yageo
R298 R304 R305 = RES_0402_0R Jumper: Thick Film Resistors - SMD 0Ohm; Manufacturer 1: Vishay / Dale; Manufacturer 1 Prt. Nr.: CRCW04020000Z0EDC; Manufacturer 2 Prt. Nr.: RC0402JR-070RL; Manufacturer 2: Yageo
R299 = RES_0402_30.1k_1%: Thick Film Resistors - SMD 30.1kOhm 1%; Manufacturer 1: Vishay / Dale; Manufacturer 1 Prt. Nr.: CRCW040230K1FKEDC; Manufacturer 2 Prt. Nr.: RC0402FR-1330K1L; Manufacturer 2: Yageo
R300 = RES_0402_110R_1%: Thick Film Resistors - SMD 110Ohm 1%; Manufacturer 1: Vishay / Dale; Manufacturer 1 Prt. Nr.: CRCW0402110RFKTD; Manufacturer 2 Prt. Nr.: RC0402FR-7W110RL; Manufacturer 2: Yageo
R301 = RES_0402_10R_1%: Thick Film Resistors - SMD 10Ohm 1%; Manufacturer 1: Vishay / Dale; Manufacturer 1 Prt. Nr.: CRCW040210R0FKEE; Manufacturer 2 Prt. Nr.: RC0402FR-7W10RL; Manufacturer 2: Yageo
R302 = RES_0402_10k_1%: as R228 on sheet Power-Tree; Manufacturer 2: Yageo
R303 = RES_0402_6.04k_1%: Thick Film Resistors - SMD 6.04kOhm 1%; Manufacturer 1: Vishay / Dale; Manufacturer 1 Prt. Nr.: CRCW04026K04FKEDC; Manufacturer 2 Prt. Nr.: RC0402FR-7W6K04L; Manufacturer 2: Yageo
U33 = TPS54JB20RWWR_Switching Voltage Regulators 2.7-V to 16-V input 20-A synchronous Buck: Switching Voltage Regulators 2.7-V to 16-V input 20-A synchronous Buck; Manufacturer 1: Texas Instruments; Manufacturer 1 Prt. Nr.: TPS54JB20RWWR

## Sheet PSU_MGTAVTT_Buck.SchDoc
size A3; SheetNumber: 8; SheetTotal: 32
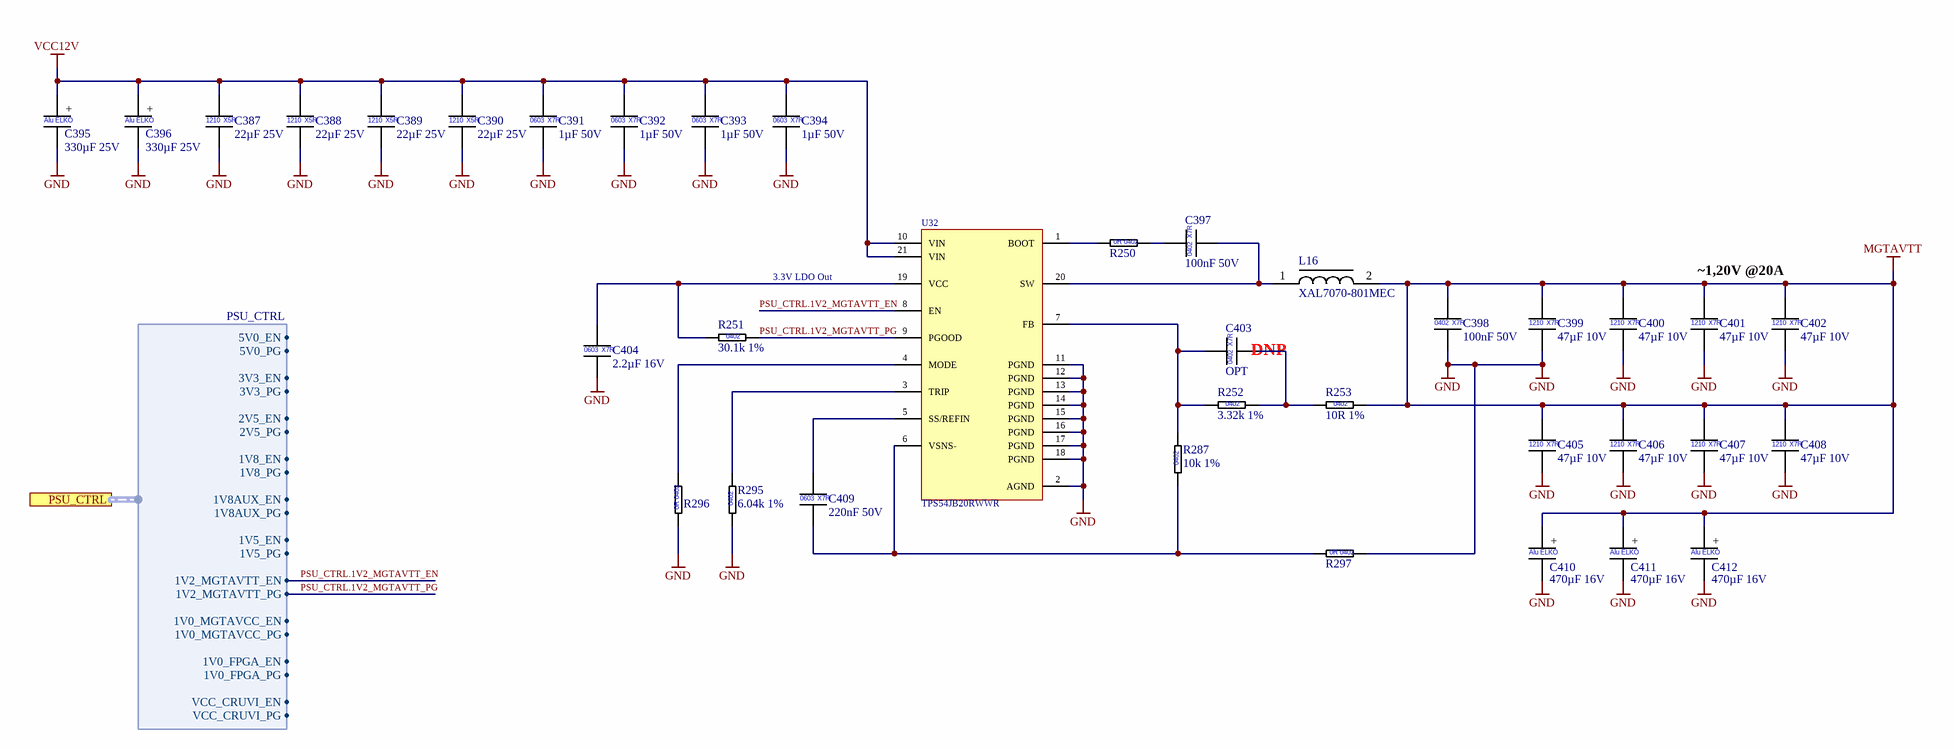
[diagram p19: PSU_MGTAVTT_Buck.SchDoc]

### Parts
C387  22µF 25V  [CAP_1210]
C388  22µF 25V  [CAP_1210]
C389  22µF 25V  [CAP_1210]
C390  22µF 25V  [CAP_1210]
C391  1µF 50V  [CAP_0603]
C392  1µF 50V  [CAP_0603]
C393  1µF 50V  [CAP_0603]
C394  1µF 50V  [CAP_0603]
C395  330µF 25V  [WCAP-PTG5_D10H12.5]
C396  330µF 25V  [WCAP-PTG5_D10H12.5]
C397  100nF 50V  [CAP_0402]
C398  100nF 50V  [CAP_0402]
C399  47µF 10V  [CAP_1210]
C400  47µF 10V  [CAP_1210]
C401  47µF 10V  [CAP_1210]
C402  47µF 10V  [CAP_1210]
C403  OPT  [CAP_0402]  (no BOM)
C404  2.2µF 16V  [CAP_0603]
C405  47µF 10V  [CAP_1210]
C406  47µF 10V  [CAP_1210]
C407  47µF 10V  [CAP_1210]
C408  47µF 10V  [CAP_1210]
C409  220nF 50V  [CAP_0603]
C410  470µF 16V  [WCAP-PTG5_D8H13]
C411  470µF 16V  [WCAP-PTG5_D8H13]
C412  470µF 16V  [WCAP-PTG5_D8H13]
L16  XAL7070-801MEC  [COILCRAFT_XAL7070]
R250  0R Jumper  [RES_0402]  (value not drawn)
R251  30.1k 1%  [RES_0402]
R252  3.32k 1%  [RES_0402]
R253  10R 1%  [RES_0402]
R287  10k 1%  [RES_0402]
R295  6.04k 1%  [RES_0402]
R296  0R Jumper  [RES_0402]  (value not drawn)
R297  0R Jumper  [RES_0402]  (value not drawn)
U32  TPS54JB20RWWR  [VQFN-HR21_RWW0021A]

### Ports
PSU_CTRL (harness PSU_CTRL, see Power-Tree[2C], PSU_MGTAVCC_Buck[1B], PSU_VCC1V0_FPGA_Buck[1B], PSU_VCC1V5_Buck[1B], PSU_VCC1V8_Buck[1B], PSU_VCC1V8AUX_Buck[1B], PSU_VCC2V5_Buck[1B], PSU_VCC3V3_Buck[1B], PSU_VCC5V_Buck[1B], PSU_VCC_CRUVI_ADJ_Buck[1B])

### Harnesses
PSU_CTRL: 5V0_EN, 5V0_PG, 3V3_EN, 3V3_PG, 2V5_EN, 2V5_PG, 1V8_EN, 1V8_PG, 1V8AUX_EN, 1V8AUX_PG, 1V5_EN, 1V5_PG, 1V2_MGTAVTT_EN, 1V2_MGTAVTT_PG, 1V0_MGTAVCC_EN, 1V0_MGTAVCC_PG, 1V0_FPGA_EN, 1V0_FPGA_PG, VCC_CRUVI_EN, VCC_CRUVI_PG

### Nets
GND: C387.2 C388.2 C389.2 C390.2 C391.2 C392.2 C393.2 C394.2 C395.2 C396.2 C398.2 C399.2 C400.2 C401.2 C402.2 C404.2 C405.2 C406.2 C407.2 C408.2 C410.2 C411.2 C412.2 R295.1 R296.1 R297.2 U32.2(AGND) U32.11(PGND) U32.12(PGND) U32.13(PGND) U32.14(PGND) U32.15(PGND) U32.16(PGND) U32.17(PGND) U32.18(PGND)
MGTAVTT: C398.1 C399.1 C400.1 C401.1 C402.1 C405.1 C406.1 C407.1 C408.1 C410.1 C411.1 C412.1 L16.2 R253.2
VCC12V: C387.1 C388.1 C389.1 C390.1 C391.1 C392.1 C393.1 C394.1 C395.1 C396.1 U32.10(VIN) U32.21(VIN)
PSU_CTRL.1V2_MGTAVTT_EN: U32.8(EN) ; port PSU_CTRL.1V2_MGTAVTT_EN
PSU_CTRL.1V2_MGTAVTT_PG: R251.2 U32.9(PGOOD) ; port PSU_CTRL.1V2_MGTAVTT_PG
NetC397_1: C397.1 R250.2
NetC397_2: C397.2 L16.1 U32.20(SW)
NetC403_1: C403.1 R252.1 R287.2 U32.7(FB)
NetC403_2: C403.2 R252.2 R253.1
NetC404_1: C404.1 R251.1 U32.19(VCC)
NetC409_1: C409.1 U32.5(SS/REFIN)
NetC409_2: C409.2 R287.1 R297.1 U32.6(VSNS-)
NetR250_1: R250.1 U32.1(BOOT)
NetR295_2: R295.2 U32.3(TRIP)
NetR296_2: R296.2 U32.4(MODE)

### Notes on the sheet
- 3.3V LDO Out
- (near C402) ~1,20V @20A
- (near C403) DNP
- Company:
- Contact:
- Customer:
- mail@pcb-arts.com
- PCB Arts GmbH
- Title:
- Project:
- The  information  contained  in  these  documents  is  confidential,  privileged  and  only  for  the information of the intended recipient and may not be used, published or redistributed Without the prior written consent from PCB Arts GmbH.
- Engineer:
- Document Number:
- Revision:
- Variant:
- Date:
- Time:
- Sheet:
- Status:
- /
- (in symbol CAP_0402_100nF_50V) X7R; 0402
- (in symbol CAP_0402_OPT) X7R; 0402
- (in symbol CAP_0603_1µF_50V_X7R_10%) 0603; X7R
- (in symbol CAP_0603_2.2µF_16V_X7R_10%) 0603; X7R
- (in symbol CAP_0603_220nF_50V_X7R_10%) 0603; X7R
- (in symbol CAP_1210_22µF_25V) 1210; X5R
- (in symbol CAP_1210_47µF_10V_X7R_10%) 1210; X7R
- (in symbol CAP_D8L9_470µF_16V) +; Alu ELKO
- (in symbol CAP_D10L12.5_330µF_25V) +; Alu ELKO
- (in symbol RES_0402_0R Jumper) 0R 0402
- (in symbol RES_0402_3.32k_1%) 0402
- (in symbol RES_0402_6.04k_1%) 0402
- (in symbol RES_0402_10k_1%) 0402
- (in symbol RES_0402_10R_1%) 0402
- (in symbol RES_0402_30.1k_1%) 0402

### Library data of the parts
C387-C390 = CAP_1210_22µF_25V: as C414 on sheet PSU_MGTAVCC_Buck; Manufacturer 2: Taiyo Yuden
C391-C394 = CAP_0603_1µF_50V_X7R_10%: as C425 on sheet PSU_MGTAVCC_Buck; Manufacturer 2: TAIYO YUDEN
C395 C396 = CAP_D10L12.5_330µF_25V: as C281 on sheet Power-Tree
C397 C398 = CAP_0402_100nF_50V: as C250 on sheet Power-Tree; Manufacturer 2: TDK
C399-C402 C405-C408 = CAP_1210_47µF_10V_X7R_10%: as C433 on sheet PSU_MGTAVCC_Buck; Manufacturer 2: KEMET
C403 = CAP_0402_OPT: as C437 on sheet PSU_MGTAVCC_Buck
C404 = CAP_0603_2.2µF_16V_X7R_10%: as C438 on sheet PSU_MGTAVCC_Buck; Manufacturer 2: TAIYO YUDEN
C409 = CAP_0603_220nF_50V_X7R_10%: as C443 on sheet PSU_MGTAVCC_Buck; Manufacturer 2: TDK
C410-C412 = CAP_D8L9_470µF_16V: as C444 on sheet PSU_MGTAVCC_Buck
L16 = XAL7070-801MEC_Power Inductors SMD 800nH Shld 20% 25.8A 2.29mOhms AECQ200: as L17 on sheet PSU_MGTAVCC_Buck; Manufacturer 1 Prt. Nr.: XAL7070-801MEC
R250 R296 R297 = RES_0402_0R Jumper: as R298 on sheet PSU_MGTAVCC_Buck; Manufacturer 2: Yageo
R251 = RES_0402_30.1k_1%: as R299 on sheet PSU_MGTAVCC_Buck; Manufacturer 2: Yageo
R252 = RES_0402_3.32k_1%: Thick Film Resistors - SMD 3.32kOhm 1%; Manufacturer 1: Vishay / Dale; Manufacturer 1 Prt. Nr.: CRCW04023K32FKEDC; Manufacturer 2 Prt. Nr.: AC0402FR-073K32L; Manufacturer 2: Yageo
R253 = RES_0402_10R_1%: as R301 on sheet PSU_MGTAVCC_Buck; Manufacturer 2: Yageo
R287 = RES_0402_10k_1%: as R228 on sheet Power-Tree; Manufacturer 2: Yageo
R295 = RES_0402_6.04k_1%: as R303 on sheet PSU_MGTAVCC_Buck; Manufacturer 2: Yageo
U32 = TPS54JB20RWWR_Switching Voltage Regulators 2.7-V to 16-V input 20-A synchronous Buck: as U33 on sheet PSU_MGTAVCC_Buck; Manufacturer 1 Prt. Nr.: TPS54JB20RWWR

## Sheet PSU_VCC1V0_FPGA_Buck.SchDoc
size A3; SheetNumber: 5; SheetTotal: 32
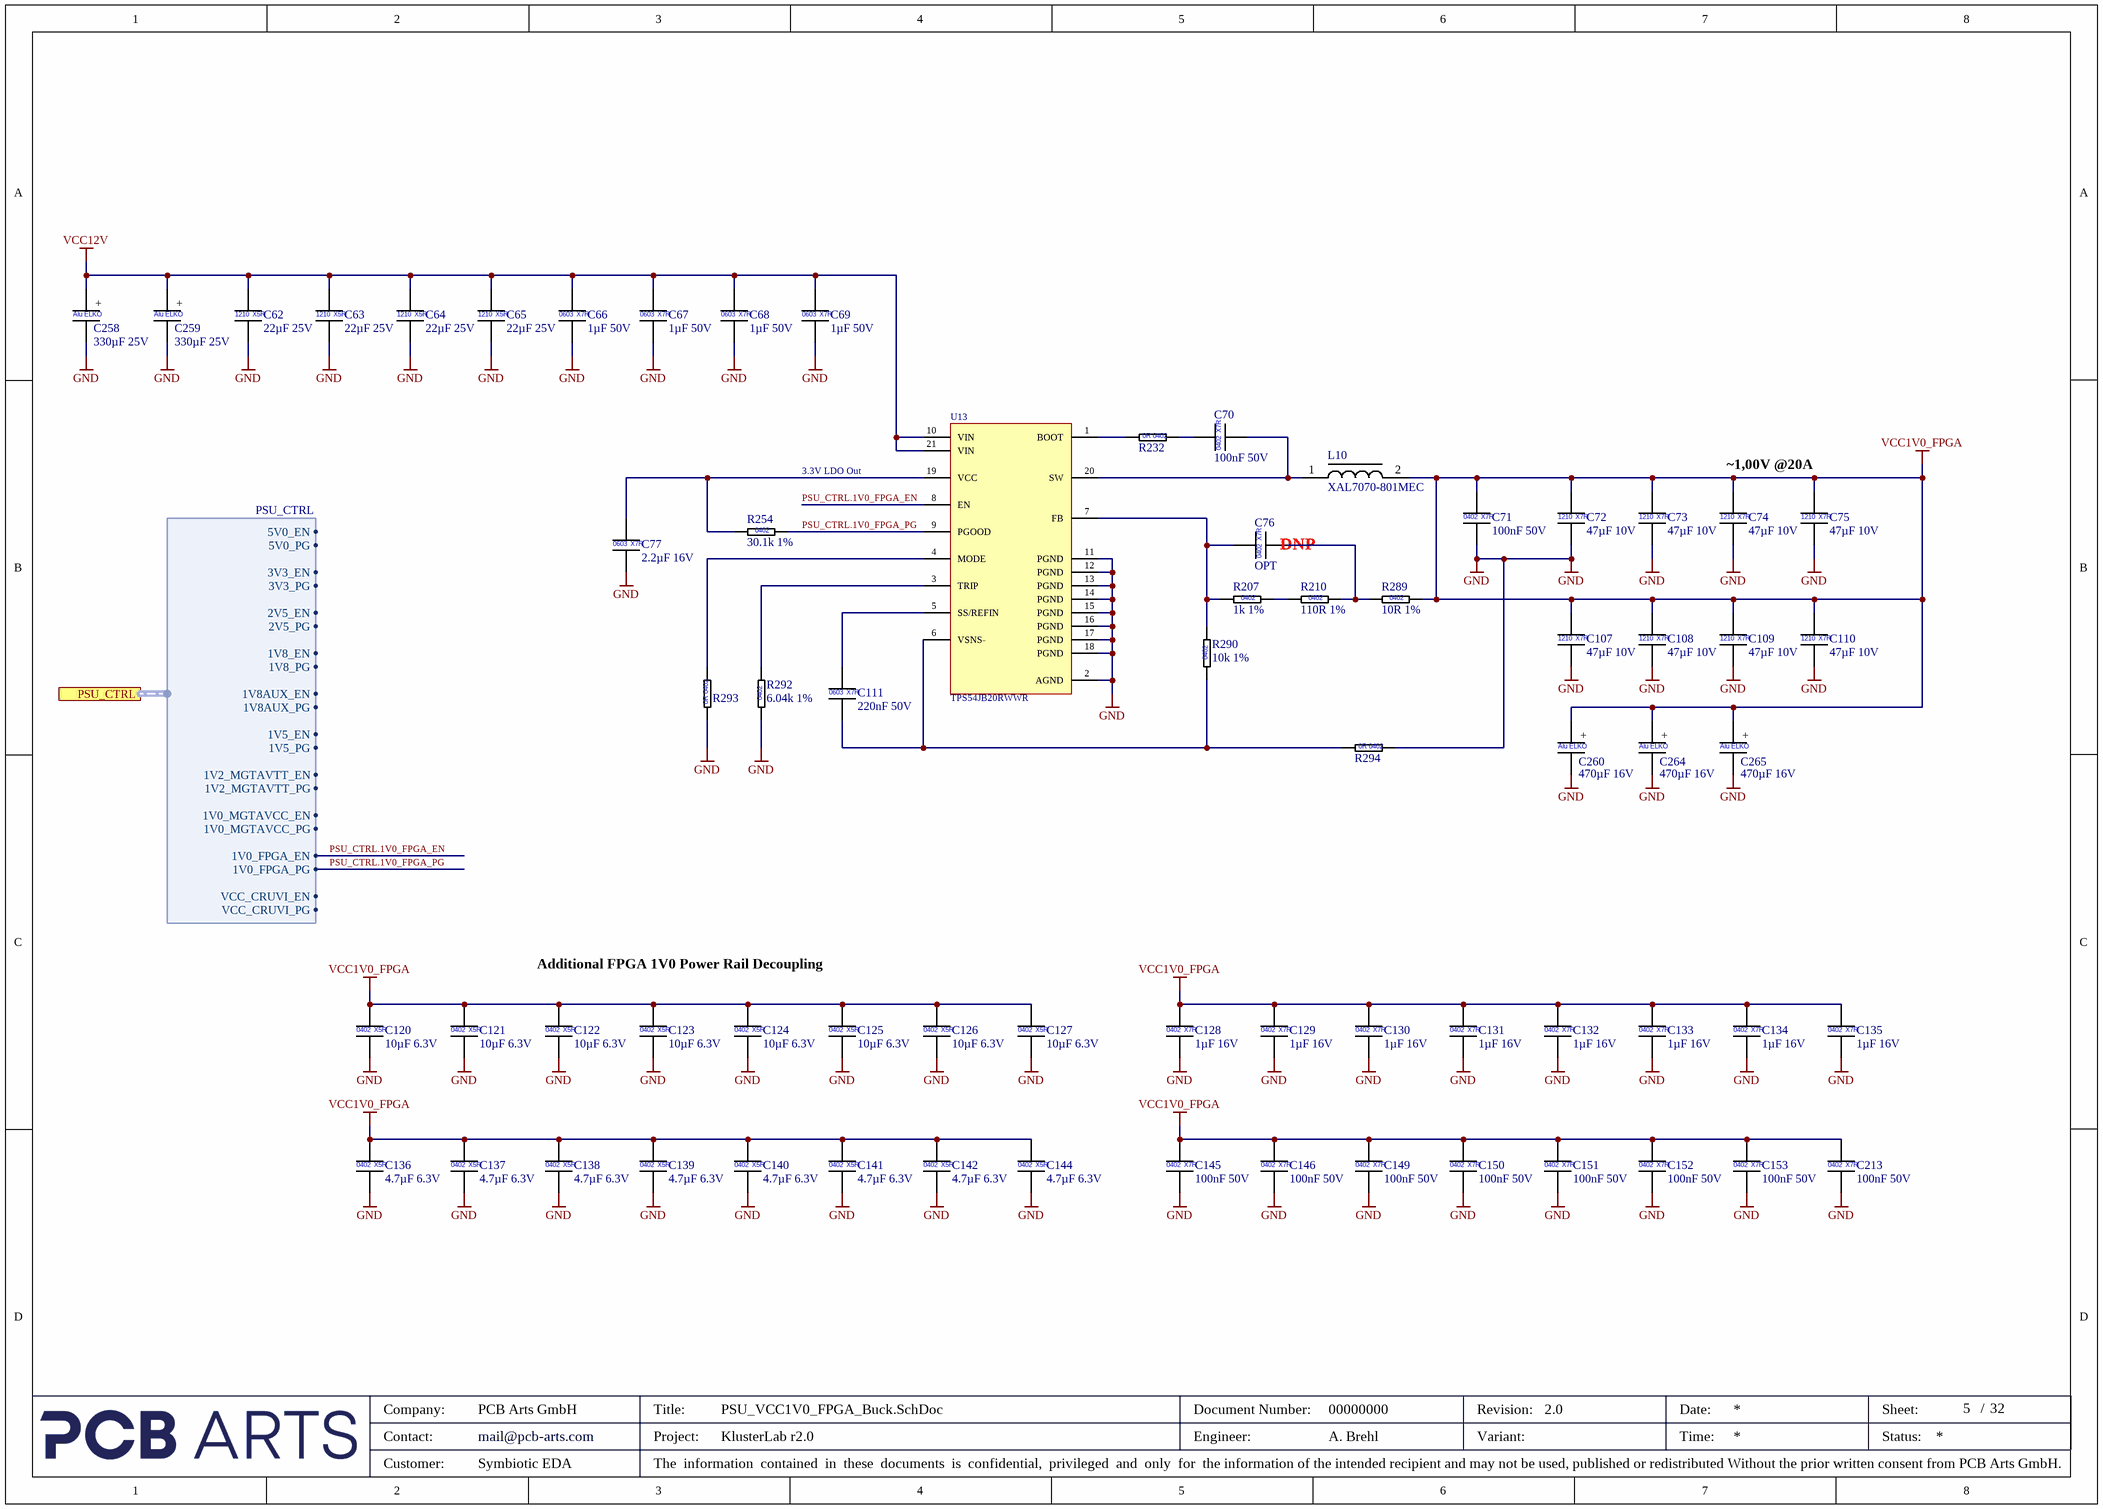
[diagram p20: PSU_VCC1V0_FPGA_Buck.SchDoc]

### Parts
C62  22µF 25V  [CAP_1210]
C63  22µF 25V  [CAP_1210]
C64  22µF 25V  [CAP_1210]
C65  22µF 25V  [CAP_1210]
C66  1µF 50V  [CAP_0603]
C67  1µF 50V  [CAP_0603]
C68  1µF 50V  [CAP_0603]
C69  1µF 50V  [CAP_0603]
C70  100nF 50V  [CAP_0402]
C71  100nF 50V  [CAP_0402]
C72  47µF 10V  [CAP_1210]
C73  47µF 10V  [CAP_1210]
C74  47µF 10V  [CAP_1210]
C75  47µF 10V  [CAP_1210]
C76  OPT  [CAP_0402]  (no BOM)
C77  2.2µF 16V  [CAP_0603]
C107  47µF 10V  [CAP_1210]
C108  47µF 10V  [CAP_1210]
C109  47µF 10V  [CAP_1210]
C110  47µF 10V  [CAP_1210]
C111  220nF 50V  [CAP_0603]
C120  10µF 6.3V  [CAP_0402_L]
C121  10µF 6.3V  [CAP_0402_L]
C122  10µF 6.3V  [CAP_0402_L]
C123  10µF 6.3V  [CAP_0402_L]
C124  10µF 6.3V  [CAP_0402_L]
C125  10µF 6.3V  [CAP_0402_L]
C126  10µF 6.3V  [CAP_0402_L]
C127  10µF 6.3V  [CAP_0402_L]
C128  1µF 16V  [CAP_0402_L]
C129  1µF 16V  [CAP_0402_L]
C130  1µF 16V  [CAP_0402_L]
C131  1µF 16V  [CAP_0402_L]
C132  1µF 16V  [CAP_0402_L]
C133  1µF 16V  [CAP_0402_L]
C134  1µF 16V  [CAP_0402_L]
C135  1µF 16V  [CAP_0402_L]
C136  4.7µF 6.3V  [CAP_0402_L]
C137  4.7µF 6.3V  [CAP_0402_L]
C138  4.7µF 6.3V  [CAP_0402_L]
C139  4.7µF 6.3V  [CAP_0402_L]
C140  4.7µF 6.3V  [CAP_0402_L]
C141  4.7µF 6.3V  [CAP_0402_L]
C142  4.7µF 6.3V  [CAP_0402_L]
C144  4.7µF 6.3V  [CAP_0402_L]
C145  100nF 50V  [CAP_0402_L]
C146  100nF 50V  [CAP_0402_L]
C149  100nF 50V  [CAP_0402_L]
C150  100nF 50V  [CAP_0402_L]
C151  100nF 50V  [CAP_0402_L]
C152  100nF 50V  [CAP_0402_L]
C153  100nF 50V  [CAP_0402_L]
C213  100nF 50V  [CAP_0402_L]
C258  330µF 25V  [WCAP-PTG5_D10H12.5]
C259  330µF 25V  [WCAP-PTG5_D10H12.5]
C260  470µF 16V  [WCAP-PTG5_D8H13]
C264  470µF 16V  [WCAP-PTG5_D8H13]
C265  470µF 16V  [WCAP-PTG5_D8H13]
L10  XAL7070-801MEC  [COILCRAFT_XAL7070]
R207  1k 1%  [RES_0402]
R210  110R 1%  [RES_0402]
R232  0R Jumper  [RES_0402]  (value not drawn)
R254  30.1k 1%  [RES_0402]
R289  10R 1%  [RES_0402]
R290  10k 1%  [RES_0402]
R292  6.04k 1%  [RES_0402]
R293  0R Jumper  [RES_0402]  (value not drawn)
R294  0R Jumper  [RES_0402]  (value not drawn)
U13  TPS54JB20RWWR  [VQFN-HR21_RWW0021A]

### Ports
PSU_CTRL (harness PSU_CTRL, see Power-Tree[2B], PSU_MGTAVCC_Buck[1B], PSU_MGTAVTT_Buck[1B], PSU_VCC1V5_Buck[1B], PSU_VCC1V8_Buck[1B], PSU_VCC1V8AUX_Buck[1B], PSU_VCC2V5_Buck[1B], PSU_VCC3V3_Buck[1B], PSU_VCC5V_Buck[1B], PSU_VCC_CRUVI_ADJ_Buck[1B])

### Harnesses
PSU_CTRL: 5V0_EN, 5V0_PG, 3V3_EN, 3V3_PG, 2V5_EN, 2V5_PG, 1V8_EN, 1V8_PG, 1V8AUX_EN, 1V8AUX_PG, 1V5_EN, 1V5_PG, 1V2_MGTAVTT_EN, 1V2_MGTAVTT_PG, 1V0_MGTAVCC_EN, 1V0_MGTAVCC_PG, 1V0_FPGA_EN, 1V0_FPGA_PG, VCC_CRUVI_EN, VCC_CRUVI_PG

### Nets
GND: C62.2 C63.2 C64.2 C65.2 C66.2 C67.2 C68.2 C69.2 C71.2 C72.2 C73.2 C74.2 C75.2 C77.2 C107.2 C108.2 C109.2 C110.2 C120.2 C121.2 C122.2 C123.2 C124.2 C125.2 C126.2 C127.2 C128.2 C129.2 C130.2 C131.2 C132.2 C133.2 C134.2 C135.2 C136.2 C137.2 C138.2 C139.2 C140.2 C141.2 C142.2 C144.2 C145.2 C146.2 C149.2 C150.2 C151.2 C152.2 C153.2 C213.2 C258.2 C259.2 C260.2 C264.2 C265.2 R292.1 R293.1 R294.2 U13.2(AGND) U13.11(PGND) U13.12(PGND) U13.13(PGND) U13.14(PGND) U13.15(PGND) U13.16(PGND) U13.17(PGND) U13.18(PGND)
VCC1V0_FPGA: C71.1 C72.1 C73.1 C74.1 C75.1 C107.1 C108.1 C109.1 C110.1 C120.1 C121.1 C122.1 C123.1 C124.1 C125.1 C126.1 C127.1 C128.1 C129.1 C130.1 C131.1 C132.1 C133.1 C134.1 C135.1 C136.1 C137.1 C138.1 C139.1 C140.1 C141.1 C142.1 C144.1 C145.1 C146.1 C149.1 C150.1 C151.1 C152.1 C153.1 C213.1 C260.1 C264.1 C265.1 L10.2 R289.2
VCC12V: C62.1 C63.1 C64.1 C65.1 C66.1 C67.1 C68.1 C69.1 C258.1 C259.1 U13.10(VIN) U13.21(VIN)
PSU_CTRL.1V0_FPGA_EN: U13.8(EN) ; port PSU_CTRL.1V0_FPGA_EN
PSU_CTRL.1V0_FPGA_PG: R254.2 U13.9(PGOOD) ; port PSU_CTRL.1V0_FPGA_PG
NetC70_1: C70.1 R232.2
NetC70_2: C70.2 L10.1 U13.20(SW)
NetC76_1: C76.1 R207.1 R290.2 U13.7(FB)
NetC76_2: C76.2 R210.2 R289.1
NetC77_1: C77.1 R254.1 U13.19(VCC)
NetC111_1: C111.1 U13.5(SS/REFIN)
NetC111_2: C111.2 R290.1 R294.1 U13.6(VSNS-)
NetR207_2: R207.2 R210.1
NetR232_1: R232.1 U13.1(BOOT)
NetR292_2: R292.2 U13.3(TRIP)
NetR293_2: R293.2 U13.4(MODE)

### Notes on the sheet
- 3.3V LDO Out
- (near C75) ~1,00V @20A
- (near C76) DNP
- Additional FPGA 1V0 Power Rail Decoupling
- Company:
- Contact:
- Customer:
- mail@pcb-arts.com
- PCB Arts GmbH
- Title:
- Project:
- The  information  contained  in  these  documents  is  confidential,  privileged  and  only  for  the information of the intended recipient and may not be used, published or redistributed Without the prior written consent from PCB Arts GmbH.
- Engineer:
- Document Number:
- Revision:
- Variant:
- Date:
- Time:
- Sheet:
- Status:
- /
- (in symbol CAP_0402_1µF_16V) 0402; X7R
- (in symbol CAP_0402_4.7µF_6.3V) 0402; X5R
- (in symbol CAP_0402_10µF_6.3V) 0402; X5R
- (in symbol CAP_0402_100nF_50V) X7R; 0402
- (in symbol CAP_0402_OPT) X7R; 0402
- (in symbol CAP_0603_1µF_50V_X7R_10%) 0603; X7R
- (in symbol CAP_0603_2.2µF_16V_X7R_10%) 0603; X7R
- (in symbol CAP_0603_220nF_50V_X7R_10%) 0603; X7R
- (in symbol CAP_1210_22µF_25V) 1210; X5R
- (in symbol CAP_1210_47µF_10V_X7R_10%) 1210; X7R
- (in symbol CAP_D8L9_470µF_16V) +; Alu ELKO
- (in symbol CAP_D10L12.5_330µF_25V) +; Alu ELKO
- (in symbol RES_0402_0R Jumper) 0R 0402
- (in symbol RES_0402_1k_1%) 0402
- (in symbol RES_0402_6.04k_1%) 0402
- (in symbol RES_0402_10k_1%) 0402
- (in symbol RES_0402_10R_1%) 0402
- (in symbol RES_0402_30.1k_1%) 0402
- (in symbol RES_0402_110R_1%) 0402

### Library data of the parts
C62-C65 = CAP_1210_22µF_25V: as C414 on sheet PSU_MGTAVCC_Buck; Manufacturer 2: Taiyo Yuden
C66-C69 = CAP_0603_1µF_50V_X7R_10%: as C425 on sheet PSU_MGTAVCC_Buck; Manufacturer 2: TAIYO YUDEN
C70 C71 C145 C146 C149-C153 C213 = CAP_0402_100nF_50V: as C250 on sheet Power-Tree; Manufacturer 2: TDK
C72-C75 C107-C110 = CAP_1210_47µF_10V_X7R_10%: as C433 on sheet PSU_MGTAVCC_Buck; Manufacturer 2: KEMET
C76 = CAP_0402_OPT: as C437 on sheet PSU_MGTAVCC_Buck
C77 = CAP_0603_2.2µF_16V_X7R_10%: as C438 on sheet PSU_MGTAVCC_Buck; Manufacturer 2: TAIYO YUDEN
C111 = CAP_0603_220nF_50V_X7R_10%: as C443 on sheet PSU_MGTAVCC_Buck; Manufacturer 2: TDK
C120-C127 = CAP_0402_10µF_6.3V: Multilayer Ceramic Capacitors MLCC - SMD/SMT 0402 6.3VDC; Manufacturer 1: Murata Electronics; Manufacturer 1 Prt. Nr.: GRM155R60J106ME05J; Manufacturer 2 Prt. Nr.: CL05A106MQ5NRNC; Manufacturer 2: Samsung Electro-Mechanics
C128-C135 = CAP_0402_1µF_16V: Multilayer Ceramic Capacitors MLCC - SMD/SMT 0402 16VDC; Manufacturer 1: Taiyo Yuden; Manufacturer 1 Prt. Nr.: EMK105BJ105MVHF; Manufacturer 2 Prt. Nr.: GRM155R61E105KA12D; Manufacturer 2: Murata Electronics
C136-C142 C144 = CAP_0402_4.7µF_6.3V: Multilayer Ceramic Capacitors MLCC - SMD/SMT 0402 6.3VDC; Manufacturer 1: Murata Electronics; Manufacturer 1 Prt. Nr.: GRM155R60J475ME47J; Manufacturer 2 Prt. Nr.: CL05A475MQ5NRNC; Manufacturer 2: Samsung Electro-Mechanics
C258 C259 = CAP_D10L12.5_330µF_25V: as C281 on sheet Power-Tree
C260 C264 C265 = CAP_D8L9_470µF_16V: as C444 on sheet PSU_MGTAVCC_Buck
L10 = XAL7070-801MEC_Power Inductors SMD 800nH Shld 20% 25.8A 2.29mOhms AECQ200: as L17 on sheet PSU_MGTAVCC_Buck; Manufacturer 1 Prt. Nr.: XAL7070-801MEC
R207 = RES_0402_1k_1%: as R288 on sheet PSU_MGTAVCC_Buck; Manufacturer 2: Yageo
R210 = RES_0402_110R_1%: as R300 on sheet PSU_MGTAVCC_Buck; Manufacturer 2: Yageo
R232 R293 R294 = RES_0402_0R Jumper: as R298 on sheet PSU_MGTAVCC_Buck; Manufacturer 2: Yageo
R254 = RES_0402_30.1k_1%: as R299 on sheet PSU_MGTAVCC_Buck; Manufacturer 2: Yageo
R289 = RES_0402_10R_1%: as R301 on sheet PSU_MGTAVCC_Buck; Manufacturer 2: Yageo
R290 = RES_0402_10k_1%: as R228 on sheet Power-Tree; Manufacturer 2: Yageo
R292 = RES_0402_6.04k_1%: as R303 on sheet PSU_MGTAVCC_Buck; Manufacturer 2: Yageo
U13 = TPS54JB20RWWR_Switching Voltage Regulators 2.7-V to 16-V input 20-A synchronous Buck: as U33 on sheet PSU_MGTAVCC_Buck; Manufacturer 1 Prt. Nr.: TPS54JB20RWWR

## Sheet PSU_VCC1V5_Buck.SchDoc
size A3; SheetNumber: 7; SheetTotal: 32
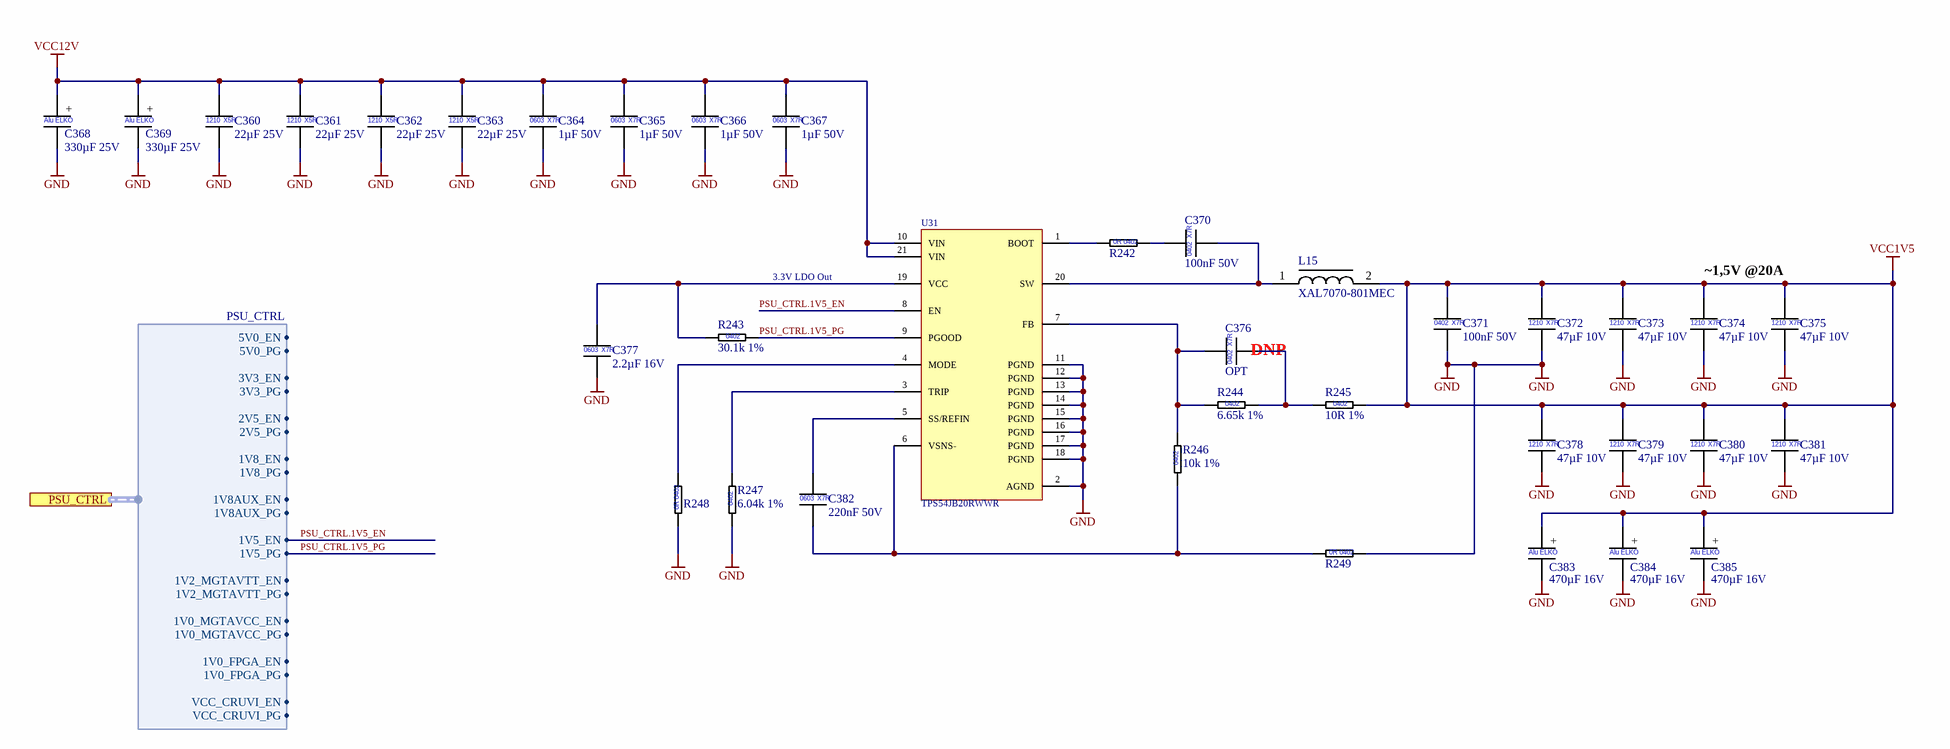
[diagram p21: PSU_VCC1V5_Buck.SchDoc]

### Parts
C360  22µF 25V  [CAP_1210]
C361  22µF 25V  [CAP_1210]
C362  22µF 25V  [CAP_1210]
C363  22µF 25V  [CAP_1210]
C364  1µF 50V  [CAP_0603]
C365  1µF 50V  [CAP_0603]
C366  1µF 50V  [CAP_0603]
C367  1µF 50V  [CAP_0603]
C368  330µF 25V  [WCAP-PTG5_D10H12.5]
C369  330µF 25V  [WCAP-PTG5_D10H12.5]
C370  100nF 50V  [CAP_0402]
C371  100nF 50V  [CAP_0402]
C372  47µF 10V  [CAP_1210]
C373  47µF 10V  [CAP_1210]
C374  47µF 10V  [CAP_1210]
C375  47µF 10V  [CAP_1210]
C376  OPT  [CAP_0402]  (no BOM)
C377  2.2µF 16V  [CAP_0603]
C378  47µF 10V  [CAP_1210]
C379  47µF 10V  [CAP_1210]
C380  47µF 10V  [CAP_1210]
C381  47µF 10V  [CAP_1210]
C382  220nF 50V  [CAP_0603]
C383  470µF 16V  [WCAP-PTG5_D8H13]
C384  470µF 16V  [WCAP-PTG5_D8H13]
C385  470µF 16V  [WCAP-PTG5_D8H13]
L15  XAL7070-801MEC  [COILCRAFT_XAL7070]
R242  0R Jumper  [RES_0402]  (value not drawn)
R243  30.1k 1%  [RES_0402]
R244  6.65k 1%  [RES_0402]
R245  10R 1%  [RES_0402]
R246  10k 1%  [RES_0402]
R247  6.04k 1%  [RES_0402]
R248  0R Jumper  [RES_0402]  (value not drawn)
R249  0R Jumper  [RES_0402]  (value not drawn)
U31  TPS54JB20RWWR  [VQFN-HR21_RWW0021A]

### Ports
PSU_CTRL (harness PSU_CTRL, see Power-Tree[2C], PSU_MGTAVCC_Buck[1B], PSU_MGTAVTT_Buck[1B], PSU_VCC1V0_FPGA_Buck[1B], PSU_VCC1V8_Buck[1B], PSU_VCC1V8AUX_Buck[1B], PSU_VCC2V5_Buck[1B], PSU_VCC3V3_Buck[1B], PSU_VCC5V_Buck[1B], PSU_VCC_CRUVI_ADJ_Buck[1B])

### Harnesses
PSU_CTRL: 5V0_EN, 5V0_PG, 3V3_EN, 3V3_PG, 2V5_EN, 2V5_PG, 1V8_EN, 1V8_PG, 1V8AUX_EN, 1V8AUX_PG, 1V5_EN, 1V5_PG, 1V2_MGTAVTT_EN, 1V2_MGTAVTT_PG, 1V0_MGTAVCC_EN, 1V0_MGTAVCC_PG, 1V0_FPGA_EN, 1V0_FPGA_PG, VCC_CRUVI_EN, VCC_CRUVI_PG

### Nets
GND: C360.2 C361.2 C362.2 C363.2 C364.2 C365.2 C366.2 C367.2 C368.2 C369.2 C371.2 C372.2 C373.2 C374.2 C375.2 C377.2 C378.2 C379.2 C380.2 C381.2 C383.2 C384.2 C385.2 R247.1 R248.1 R249.2 U31.2(AGND) U31.11(PGND) U31.12(PGND) U31.13(PGND) U31.14(PGND) U31.15(PGND) U31.16(PGND) U31.17(PGND) U31.18(PGND)
VCC1V5: C371.1 C372.1 C373.1 C374.1 C375.1 C378.1 C379.1 C380.1 C381.1 C383.1 C384.1 C385.1 L15.2 R245.2
VCC12V: C360.1 C361.1 C362.1 C363.1 C364.1 C365.1 C366.1 C367.1 C368.1 C369.1 U31.10(VIN) U31.21(VIN)
PSU_CTRL.1V5_EN: U31.8(EN) ; port PSU_CTRL.1V5_EN
PSU_CTRL.1V5_PG: R243.2 U31.9(PGOOD) ; port PSU_CTRL.1V5_PG
NetC370_1: C370.1 R242.2
NetC370_2: C370.2 L15.1 U31.20(SW)
NetC376_1: C376.1 R244.1 R246.2 U31.7(FB)
NetC376_2: C376.2 R244.2 R245.1
NetC377_1: C377.1 R243.1 U31.19(VCC)
NetC382_1: C382.1 U31.5(SS/REFIN)
NetC382_2: C382.2 R246.1 R249.1 U31.6(VSNS-)
NetR242_1: R242.1 U31.1(BOOT)
NetR247_2: R247.2 U31.3(TRIP)
NetR248_2: R248.2 U31.4(MODE)

### Notes on the sheet
- 3.3V LDO Out
- (near C375) ~1,5V @20A
- (near C376) DNP
- Company:
- Contact:
- Customer:
- mail@pcb-arts.com
- PCB Arts GmbH
- Title:
- Project:
- The  information  contained  in  these  documents  is  confidential,  privileged  and  only  for  the information of the intended recipient and may not be used, published or redistributed Without the prior written consent from PCB Arts GmbH.
- Engineer:
- Document Number:
- Revision:
- Variant:
- Date:
- Time:
- Sheet:
- Status:
- /
- (in symbol CAP_0402_100nF_50V) X7R; 0402
- (in symbol CAP_0402_OPT) X7R; 0402
- (in symbol CAP_0603_1µF_50V_X7R_10%) 0603; X7R
- (in symbol CAP_0603_2.2µF_16V_X7R_10%) 0603; X7R
- (in symbol CAP_0603_220nF_50V_X7R_10%) 0603; X7R
- (in symbol CAP_1210_22µF_25V) 1210; X5R
- (in symbol CAP_1210_47µF_10V_X7R_10%) 1210; X7R
- (in symbol CAP_D8L9_470µF_16V) +; Alu ELKO
- (in symbol CAP_D10L12.5_330µF_25V) +; Alu ELKO
- (in symbol RES_0402_0R Jumper) 0R 0402
- (in symbol RES_0402_6.04k_1%) 0402
- (in symbol RES_0402_6.65k_1%) 0402
- (in symbol RES_0402_10k_1%) 0402
- (in symbol RES_0402_10R_1%) 0402
- (in symbol RES_0402_30.1k_1%) 0402

### Library data of the parts
C360-C363 = CAP_1210_22µF_25V: as C414 on sheet PSU_MGTAVCC_Buck; Manufacturer 2: Taiyo Yuden
C364-C367 = CAP_0603_1µF_50V_X7R_10%: as C425 on sheet PSU_MGTAVCC_Buck; Manufacturer 2: TAIYO YUDEN
C368 C369 = CAP_D10L12.5_330µF_25V: as C281 on sheet Power-Tree
C370 C371 = CAP_0402_100nF_50V: as C250 on sheet Power-Tree; Manufacturer 2: TDK
C372-C375 C378-C381 = CAP_1210_47µF_10V_X7R_10%: as C433 on sheet PSU_MGTAVCC_Buck; Manufacturer 2: KEMET
C376 = CAP_0402_OPT: as C437 on sheet PSU_MGTAVCC_Buck
C377 = CAP_0603_2.2µF_16V_X7R_10%: as C438 on sheet PSU_MGTAVCC_Buck; Manufacturer 2: TAIYO YUDEN
C382 = CAP_0603_220nF_50V_X7R_10%: as C443 on sheet PSU_MGTAVCC_Buck; Manufacturer 2: TDK
C383-C385 = CAP_D8L9_470µF_16V: as C444 on sheet PSU_MGTAVCC_Buck
L15 = XAL7070-801MEC_Power Inductors SMD 800nH Shld 20% 25.8A 2.29mOhms AECQ200: as L17 on sheet PSU_MGTAVCC_Buck; Manufacturer 1 Prt. Nr.: XAL7070-801MEC
R242 R248 R249 = RES_0402_0R Jumper: as R298 on sheet PSU_MGTAVCC_Buck; Manufacturer 2: Yageo
R243 = RES_0402_30.1k_1%: as R299 on sheet PSU_MGTAVCC_Buck; Manufacturer 2: Yageo
R244 = RES_0402_6.65k_1%: Thick Film Resistors - SMD 6.65kOhm 1%; Manufacturer 1: Vishay / Dale; Manufacturer 1 Prt. Nr.: CRCW04026K65FKEDC; Manufacturer 2 Prt. Nr.: RC0402FR-136K65L; Manufacturer 2: Yageo
R245 = RES_0402_10R_1%: as R301 on sheet PSU_MGTAVCC_Buck; Manufacturer 2: Yageo
R246 = RES_0402_10k_1%: as R228 on sheet Power-Tree; Manufacturer 2: Yageo
R247 = RES_0402_6.04k_1%: as R303 on sheet PSU_MGTAVCC_Buck; Manufacturer 2: Yageo
U31 = TPS54JB20RWWR_Switching Voltage Regulators 2.7-V to 16-V input 20-A synchronous Buck: as U33 on sheet PSU_MGTAVCC_Buck; Manufacturer 1 Prt. Nr.: TPS54JB20RWWR

## Sheet PSU_VCC1V8AUX_Buck.SchDoc
size A3; SheetNumber: 6; SheetTotal: 32
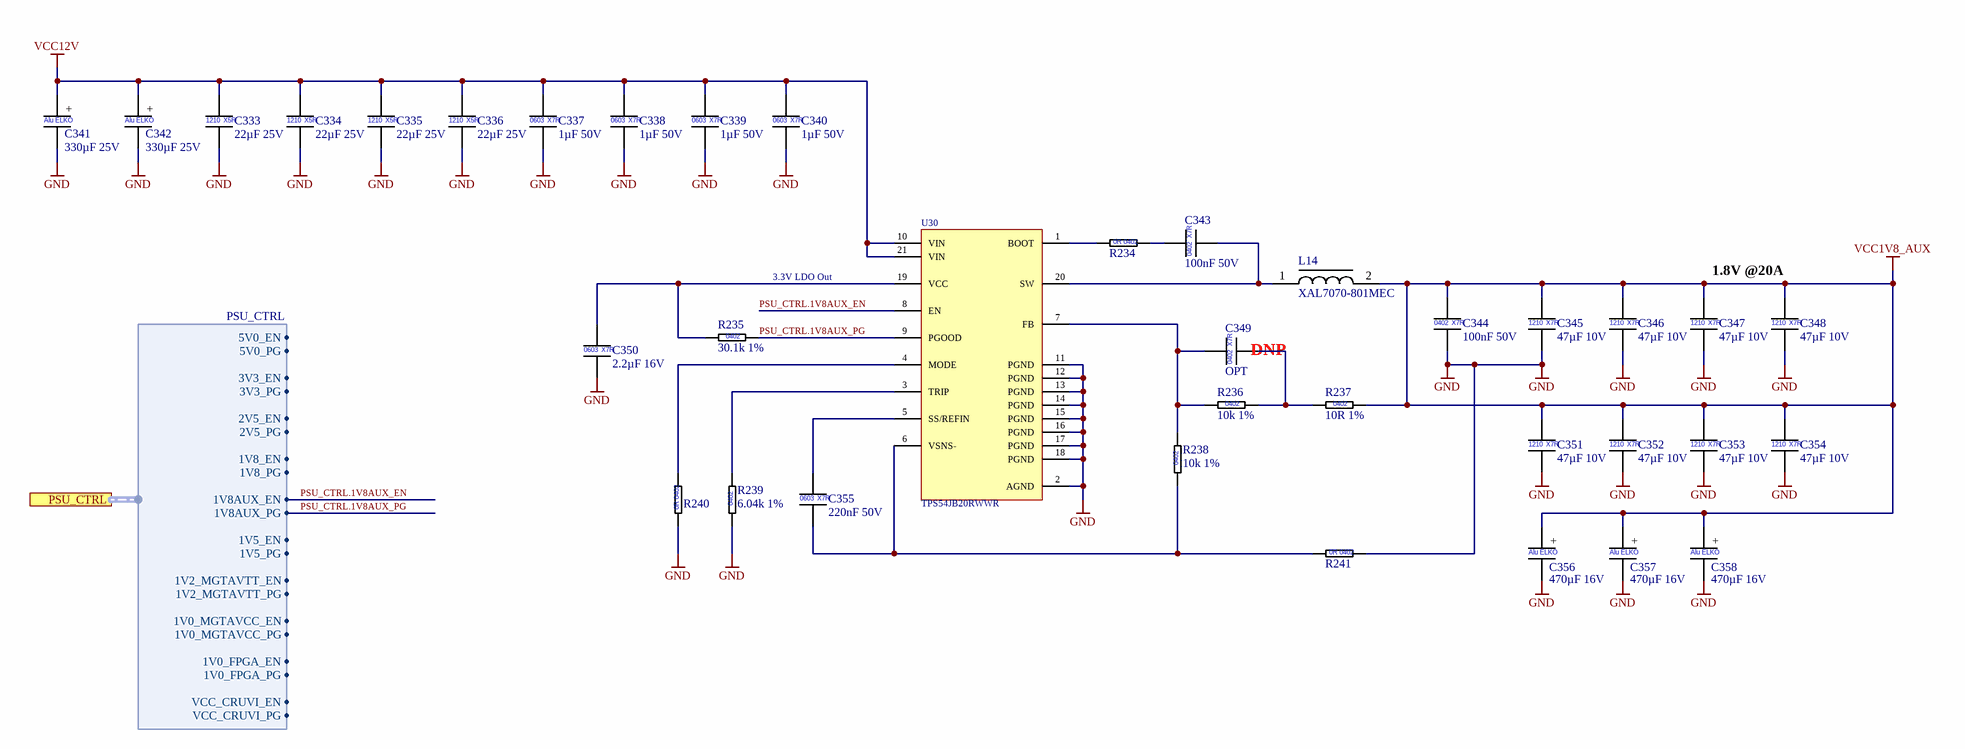
[diagram p22: PSU_VCC1V8AUX_Buck.SchDoc]

### Parts
C333  22µF 25V  [CAP_1210]
C334  22µF 25V  [CAP_1210]
C335  22µF 25V  [CAP_1210]
C336  22µF 25V  [CAP_1210]
C337  1µF 50V  [CAP_0603]
C338  1µF 50V  [CAP_0603]
C339  1µF 50V  [CAP_0603]
C340  1µF 50V  [CAP_0603]
C341  330µF 25V  [WCAP-PTG5_D10H12.5]
C342  330µF 25V  [WCAP-PTG5_D10H12.5]
C343  100nF 50V  [CAP_0402]
C344  100nF 50V  [CAP_0402]
C345  47µF 10V  [CAP_1210]
C346  47µF 10V  [CAP_1210]
C347  47µF 10V  [CAP_1210]
C348  47µF 10V  [CAP_1210]
C349  OPT  [CAP_0402]  (no BOM)
C350  2.2µF 16V  [CAP_0603]
C351  47µF 10V  [CAP_1210]
C352  47µF 10V  [CAP_1210]
C353  47µF 10V  [CAP_1210]
C354  47µF 10V  [CAP_1210]
C355  220nF 50V  [CAP_0603]
C356  470µF 16V  [WCAP-PTG5_D8H13]
C357  470µF 16V  [WCAP-PTG5_D8H13]
C358  470µF 16V  [WCAP-PTG5_D8H13]
L14  XAL7070-801MEC  [COILCRAFT_XAL7070]
R234  0R Jumper  [RES_0402]  (value not drawn)
R235  30.1k 1%  [RES_0402]
R236  10k 1%  [RES_0402]
R237  10R 1%  [RES_0402]
R238  10k 1%  [RES_0402]
R239  6.04k 1%  [RES_0402]
R240  0R Jumper  [RES_0402]  (value not drawn)
R241  0R Jumper  [RES_0402]  (value not drawn)
U30  TPS54JB20RWWR  [VQFN-HR21_RWW0021A]

### Ports
PSU_CTRL (harness PSU_CTRL, see Power-Tree[2B], PSU_MGTAVCC_Buck[1B], PSU_MGTAVTT_Buck[1B], PSU_VCC1V0_FPGA_Buck[1B], PSU_VCC1V5_Buck[1B], PSU_VCC1V8_Buck[1B], PSU_VCC2V5_Buck[1B], PSU_VCC3V3_Buck[1B], PSU_VCC5V_Buck[1B], PSU_VCC_CRUVI_ADJ_Buck[1B])

### Harnesses
PSU_CTRL: 5V0_EN, 5V0_PG, 3V3_EN, 3V3_PG, 2V5_EN, 2V5_PG, 1V8_EN, 1V8_PG, 1V8AUX_EN, 1V8AUX_PG, 1V5_EN, 1V5_PG, 1V2_MGTAVTT_EN, 1V2_MGTAVTT_PG, 1V0_MGTAVCC_EN, 1V0_MGTAVCC_PG, 1V0_FPGA_EN, 1V0_FPGA_PG, VCC_CRUVI_EN, VCC_CRUVI_PG

### Nets
GND: C333.2 C334.2 C335.2 C336.2 C337.2 C338.2 C339.2 C340.2 C341.2 C342.2 C344.2 C345.2 C346.2 C347.2 C348.2 C350.2 C351.2 C352.2 C353.2 C354.2 C356.2 C357.2 C358.2 R239.1 R240.1 R241.2 U30.2(AGND) U30.11(PGND) U30.12(PGND) U30.13(PGND) U30.14(PGND) U30.15(PGND) U30.16(PGND) U30.17(PGND) U30.18(PGND)
VCC1V8_AUX: C344.1 C345.1 C346.1 C347.1 C348.1 C351.1 C352.1 C353.1 C354.1 C356.1 C357.1 C358.1 L14.2 R237.2
VCC12V: C333.1 C334.1 C335.1 C336.1 C337.1 C338.1 C339.1 C340.1 C341.1 C342.1 U30.10(VIN) U30.21(VIN)
PSU_CTRL.1V8AUX_EN: U30.8(EN) ; port PSU_CTRL.1V8AUX_EN
PSU_CTRL.1V8AUX_PG: R235.2 U30.9(PGOOD) ; port PSU_CTRL.1V8AUX_PG
NetC343_1: C343.1 R234.2
NetC343_2: C343.2 L14.1 U30.20(SW)
NetC349_1: C349.1 R236.1 R238.2 U30.7(FB)
NetC349_2: C349.2 R236.2 R237.1
NetC350_1: C350.1 R235.1 U30.19(VCC)
NetC355_1: C355.1 U30.5(SS/REFIN)
NetC355_2: C355.2 R238.1 R241.1 U30.6(VSNS-)
NetR234_1: R234.1 U30.1(BOOT)
NetR239_2: R239.2 U30.3(TRIP)
NetR240_2: R240.2 U30.4(MODE)

### Notes on the sheet
- 3.3V LDO Out
- (near C348) 1.8V @20A
- (near C349) DNP
- Company:
- Contact:
- Customer:
- mail@pcb-arts.com
- PCB Arts GmbH
- Title:
- Project:
- The  information  contained  in  these  documents  is  confidential,  privileged  and  only  for  the information of the intended recipient and may not be used, published or redistributed Without the prior written consent from PCB Arts GmbH.
- Engineer:
- Document Number:
- Revision:
- Variant:
- Date:
- Time:
- Sheet:
- Status:
- /
- (in symbol CAP_0402_100nF_50V) X7R; 0402
- (in symbol CAP_0402_OPT) X7R; 0402
- (in symbol CAP_0603_1µF_50V_X7R_10%) 0603; X7R
- (in symbol CAP_0603_2.2µF_16V_X7R_10%) 0603; X7R
- (in symbol CAP_0603_220nF_50V_X7R_10%) 0603; X7R
- (in symbol CAP_1210_22µF_25V) 1210; X5R
- (in symbol CAP_1210_47µF_10V_X7R_10%) 1210; X7R
- (in symbol CAP_D8L9_470µF_16V) +; Alu ELKO
- (in symbol CAP_D10L12.5_330µF_25V) +; Alu ELKO
- (in symbol RES_0402_0R Jumper) 0R 0402
- (in symbol RES_0402_6.04k_1%) 0402
- (in symbol RES_0402_10k_1%) 0402
- (in symbol RES_0402_10R_1%) 0402
- (in symbol RES_0402_30.1k_1%) 0402

### Library data of the parts
C333-C336 = CAP_1210_22µF_25V: as C414 on sheet PSU_MGTAVCC_Buck; Manufacturer 2: Taiyo Yuden
C337-C340 = CAP_0603_1µF_50V_X7R_10%: as C425 on sheet PSU_MGTAVCC_Buck; Manufacturer 2: TAIYO YUDEN
C341 C342 = CAP_D10L12.5_330µF_25V: as C281 on sheet Power-Tree
C343 C344 = CAP_0402_100nF_50V: as C250 on sheet Power-Tree; Manufacturer 2: TDK
C345-C348 C351-C354 = CAP_1210_47µF_10V_X7R_10%: as C433 on sheet PSU_MGTAVCC_Buck; Manufacturer 2: KEMET
C349 = CAP_0402_OPT: as C437 on sheet PSU_MGTAVCC_Buck
C350 = CAP_0603_2.2µF_16V_X7R_10%: as C438 on sheet PSU_MGTAVCC_Buck; Manufacturer 2: TAIYO YUDEN
C355 = CAP_0603_220nF_50V_X7R_10%: as C443 on sheet PSU_MGTAVCC_Buck; Manufacturer 2: TDK
C356-C358 = CAP_D8L9_470µF_16V: as C444 on sheet PSU_MGTAVCC_Buck
L14 = XAL7070-801MEC_Power Inductors SMD 800nH Shld 20% 25.8A 2.29mOhms AECQ200: as L17 on sheet PSU_MGTAVCC_Buck; Manufacturer 1 Prt. Nr.: XAL7070-801MEC
R234 R240 R241 = RES_0402_0R Jumper: as R298 on sheet PSU_MGTAVCC_Buck; Manufacturer 2: Yageo
R235 = RES_0402_30.1k_1%: as R299 on sheet PSU_MGTAVCC_Buck; Manufacturer 2: Yageo
R236 R238 = RES_0402_10k_1%: as R228 on sheet Power-Tree; Manufacturer 2: Yageo
R237 = RES_0402_10R_1%: as R301 on sheet PSU_MGTAVCC_Buck; Manufacturer 2: Yageo
R239 = RES_0402_6.04k_1%: as R303 on sheet PSU_MGTAVCC_Buck; Manufacturer 2: Yageo
U30 = TPS54JB20RWWR_Switching Voltage Regulators 2.7-V to 16-V input 20-A synchronous Buck: as U33 on sheet PSU_MGTAVCC_Buck; Manufacturer 1 Prt. Nr.: TPS54JB20RWWR

## Sheet PSU_VCC1V8_Buck.SchDoc
size A3; SheetNumber: 4; SheetTotal: 32
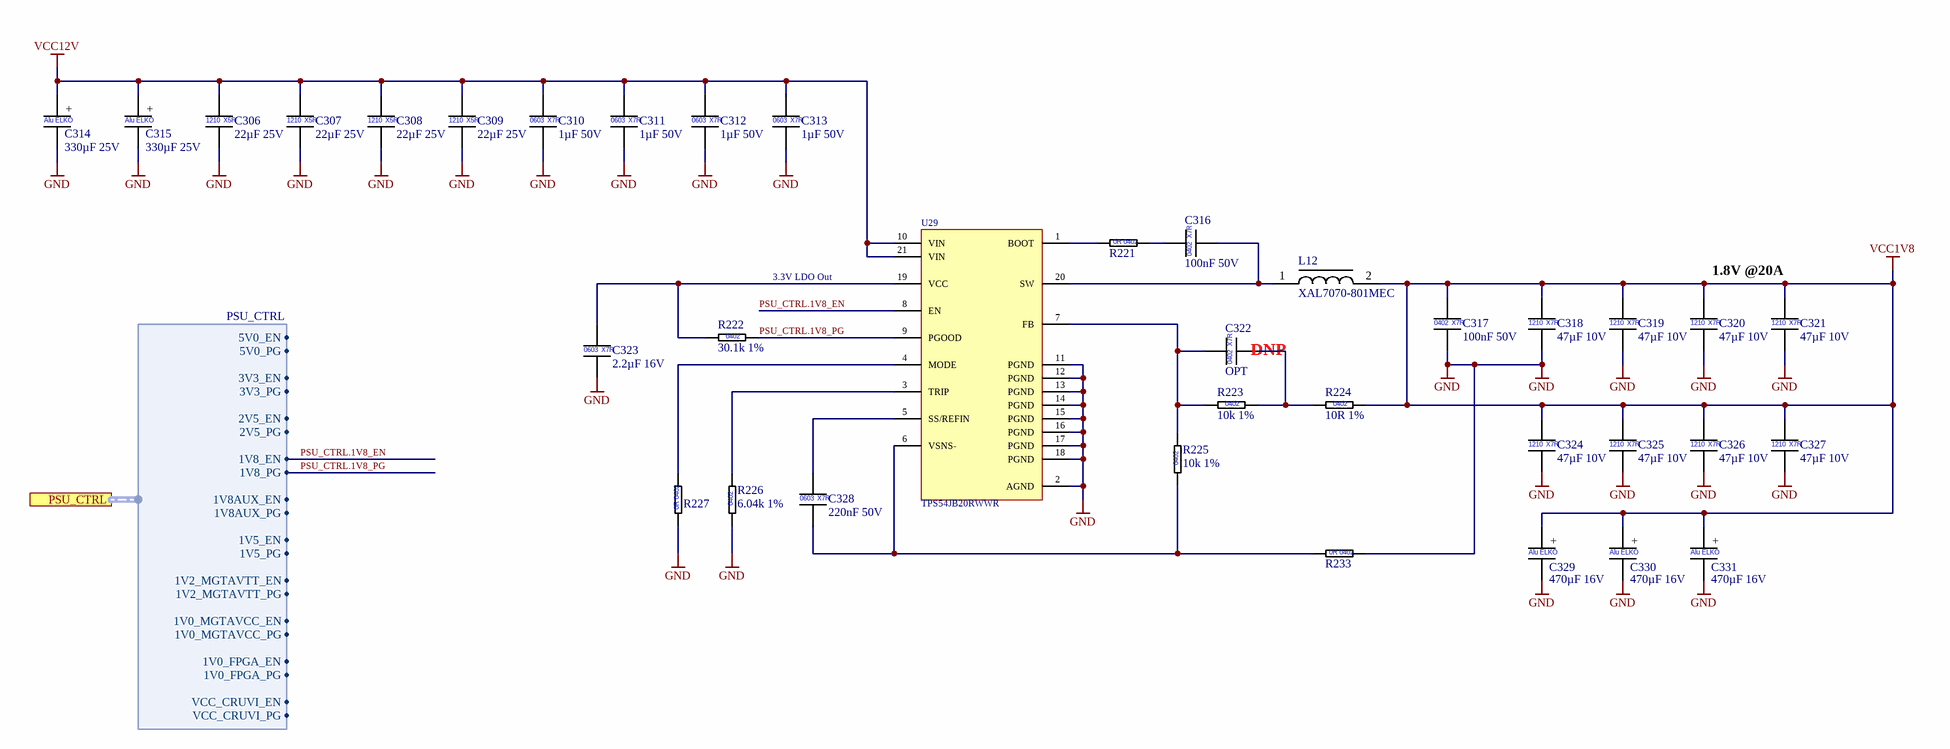
[diagram p23: PSU_VCC1V8_Buck.SchDoc]

### Parts
C306  22µF 25V  [CAP_1210]
C307  22µF 25V  [CAP_1210]
C308  22µF 25V  [CAP_1210]
C309  22µF 25V  [CAP_1210]
C310  1µF 50V  [CAP_0603]
C311  1µF 50V  [CAP_0603]
C312  1µF 50V  [CAP_0603]
C313  1µF 50V  [CAP_0603]
C314  330µF 25V  [WCAP-PTG5_D10H12.5]
C315  330µF 25V  [WCAP-PTG5_D10H12.5]
C316  100nF 50V  [CAP_0402]
C317  100nF 50V  [CAP_0402]
C318  47µF 10V  [CAP_1210]
C319  47µF 10V  [CAP_1210]
C320  47µF 10V  [CAP_1210]
C321  47µF 10V  [CAP_1210]
C322  OPT  [CAP_0402]  (no BOM)
C323  2.2µF 16V  [CAP_0603]
C324  47µF 10V  [CAP_1210]
C325  47µF 10V  [CAP_1210]
C326  47µF 10V  [CAP_1210]
C327  47µF 10V  [CAP_1210]
C328  220nF 50V  [CAP_0603]
C329  470µF 16V  [WCAP-PTG5_D8H13]
C330  470µF 16V  [WCAP-PTG5_D8H13]
C331  470µF 16V  [WCAP-PTG5_D8H13]
L12  XAL7070-801MEC  [COILCRAFT_XAL7070]
R221  0R Jumper  [RES_0402]  (value not drawn)
R222  30.1k 1%  [RES_0402]
R223  10k 1%  [RES_0402]
R224  10R 1%  [RES_0402]
R225  10k 1%  [RES_0402]
R226  6.04k 1%  [RES_0402]
R227  0R Jumper  [RES_0402]  (value not drawn)
R233  0R Jumper  [RES_0402]  (value not drawn)
U29  TPS54JB20RWWR  [VQFN-HR21_RWW0021A]

### Ports
PSU_CTRL (harness PSU_CTRL, see Power-Tree[2C], PSU_MGTAVCC_Buck[1B], PSU_MGTAVTT_Buck[1B], PSU_VCC1V0_FPGA_Buck[1B], PSU_VCC1V5_Buck[1B], PSU_VCC1V8AUX_Buck[1B], PSU_VCC2V5_Buck[1B], PSU_VCC3V3_Buck[1B], PSU_VCC5V_Buck[1B], PSU_VCC_CRUVI_ADJ_Buck[1B])

### Harnesses
PSU_CTRL: 5V0_EN, 5V0_PG, 3V3_EN, 3V3_PG, 2V5_EN, 2V5_PG, 1V8_EN, 1V8_PG, 1V8AUX_EN, 1V8AUX_PG, 1V5_EN, 1V5_PG, 1V2_MGTAVTT_EN, 1V2_MGTAVTT_PG, 1V0_MGTAVCC_EN, 1V0_MGTAVCC_PG, 1V0_FPGA_EN, 1V0_FPGA_PG, VCC_CRUVI_EN, VCC_CRUVI_PG

### Nets
GND: C306.2 C307.2 C308.2 C309.2 C310.2 C311.2 C312.2 C313.2 C314.2 C315.2 C317.2 C318.2 C319.2 C320.2 C321.2 C323.2 C324.2 C325.2 C326.2 C327.2 C329.2 C330.2 C331.2 R226.1 R227.1 R233.2 U29.2(AGND) U29.11(PGND) U29.12(PGND) U29.13(PGND) U29.14(PGND) U29.15(PGND) U29.16(PGND) U29.17(PGND) U29.18(PGND)
VCC1V8: C317.1 C318.1 C319.1 C320.1 C321.1 C324.1 C325.1 C326.1 C327.1 C329.1 C330.1 C331.1 L12.2 R224.2
VCC12V: C306.1 C307.1 C308.1 C309.1 C310.1 C311.1 C312.1 C313.1 C314.1 C315.1 U29.10(VIN) U29.21(VIN)
PSU_CTRL.1V8_EN: U29.8(EN) ; port PSU_CTRL.1V8_EN
PSU_CTRL.1V8_PG: R222.2 U29.9(PGOOD) ; port PSU_CTRL.1V8_PG
NetC316_1: C316.1 R221.2
NetC316_2: C316.2 L12.1 U29.20(SW)
NetC322_1: C322.1 R223.1 R225.2 U29.7(FB)
NetC322_2: C322.2 R223.2 R224.1
NetC323_1: C323.1 R222.1 U29.19(VCC)
NetC328_1: C328.1 U29.5(SS/REFIN)
NetC328_2: C328.2 R225.1 R233.1 U29.6(VSNS-)
NetR221_1: R221.1 U29.1(BOOT)
NetR226_2: R226.2 U29.3(TRIP)
NetR227_2: R227.2 U29.4(MODE)

### Notes on the sheet
- 3.3V LDO Out
- (near C321) 1.8V @20A
- (near C322) DNP
- Company:
- Contact:
- Customer:
- mail@pcb-arts.com
- PCB Arts GmbH
- Title:
- Project:
- The  information  contained  in  these  documents  is  confidential,  privileged  and  only  for  the information of the intended recipient and may not be used, published or redistributed Without the prior written consent from PCB Arts GmbH.
- Engineer:
- Document Number:
- Revision:
- Variant:
- Date:
- Time:
- Sheet:
- Status:
- /
- (in symbol CAP_0402_100nF_50V) X7R; 0402
- (in symbol CAP_0402_OPT) X7R; 0402
- (in symbol CAP_0603_1µF_50V_X7R_10%) 0603; X7R
- (in symbol CAP_0603_2.2µF_16V_X7R_10%) 0603; X7R
- (in symbol CAP_0603_220nF_50V_X7R_10%) 0603; X7R
- (in symbol CAP_1210_22µF_25V) 1210; X5R
- (in symbol CAP_1210_47µF_10V_X7R_10%) 1210; X7R
- (in symbol CAP_D8L9_470µF_16V) +; Alu ELKO
- (in symbol CAP_D10L12.5_330µF_25V) +; Alu ELKO
- (in symbol RES_0402_0R Jumper) 0R 0402
- (in symbol RES_0402_6.04k_1%) 0402
- (in symbol RES_0402_10k_1%) 0402
- (in symbol RES_0402_10R_1%) 0402
- (in symbol RES_0402_30.1k_1%) 0402

### Library data of the parts
C306-C309 = CAP_1210_22µF_25V: as C414 on sheet PSU_MGTAVCC_Buck; Manufacturer 2: Taiyo Yuden
C310-C313 = CAP_0603_1µF_50V_X7R_10%: as C425 on sheet PSU_MGTAVCC_Buck; Manufacturer 2: TAIYO YUDEN
C314 C315 = CAP_D10L12.5_330µF_25V: as C281 on sheet Power-Tree
C316 C317 = CAP_0402_100nF_50V: as C250 on sheet Power-Tree; Manufacturer 2: TDK
C318-C321 C324-C327 = CAP_1210_47µF_10V_X7R_10%: as C433 on sheet PSU_MGTAVCC_Buck; Manufacturer 2: KEMET
C322 = CAP_0402_OPT: as C437 on sheet PSU_MGTAVCC_Buck
C323 = CAP_0603_2.2µF_16V_X7R_10%: as C438 on sheet PSU_MGTAVCC_Buck; Manufacturer 2: TAIYO YUDEN
C328 = CAP_0603_220nF_50V_X7R_10%: as C443 on sheet PSU_MGTAVCC_Buck; Manufacturer 2: TDK
C329-C331 = CAP_D8L9_470µF_16V: as C444 on sheet PSU_MGTAVCC_Buck
L12 = XAL7070-801MEC_Power Inductors SMD 800nH Shld 20% 25.8A 2.29mOhms AECQ200: as L17 on sheet PSU_MGTAVCC_Buck; Manufacturer 1 Prt. Nr.: XAL7070-801MEC
R221 R227 R233 = RES_0402_0R Jumper: as R298 on sheet PSU_MGTAVCC_Buck; Manufacturer 2: Yageo
R222 = RES_0402_30.1k_1%: as R299 on sheet PSU_MGTAVCC_Buck; Manufacturer 2: Yageo
R223 R225 = RES_0402_10k_1%: as R228 on sheet Power-Tree; Manufacturer 2: Yageo
R224 = RES_0402_10R_1%: as R301 on sheet PSU_MGTAVCC_Buck; Manufacturer 2: Yageo
R226 = RES_0402_6.04k_1%: as R303 on sheet PSU_MGTAVCC_Buck; Manufacturer 2: Yageo
U29 = TPS54JB20RWWR_Switching Voltage Regulators 2.7-V to 16-V input 20-A synchronous Buck: as U33 on sheet PSU_MGTAVCC_Buck; Manufacturer 1 Prt. Nr.: TPS54JB20RWWR